# Altium project F4SDR2.PrjPcb
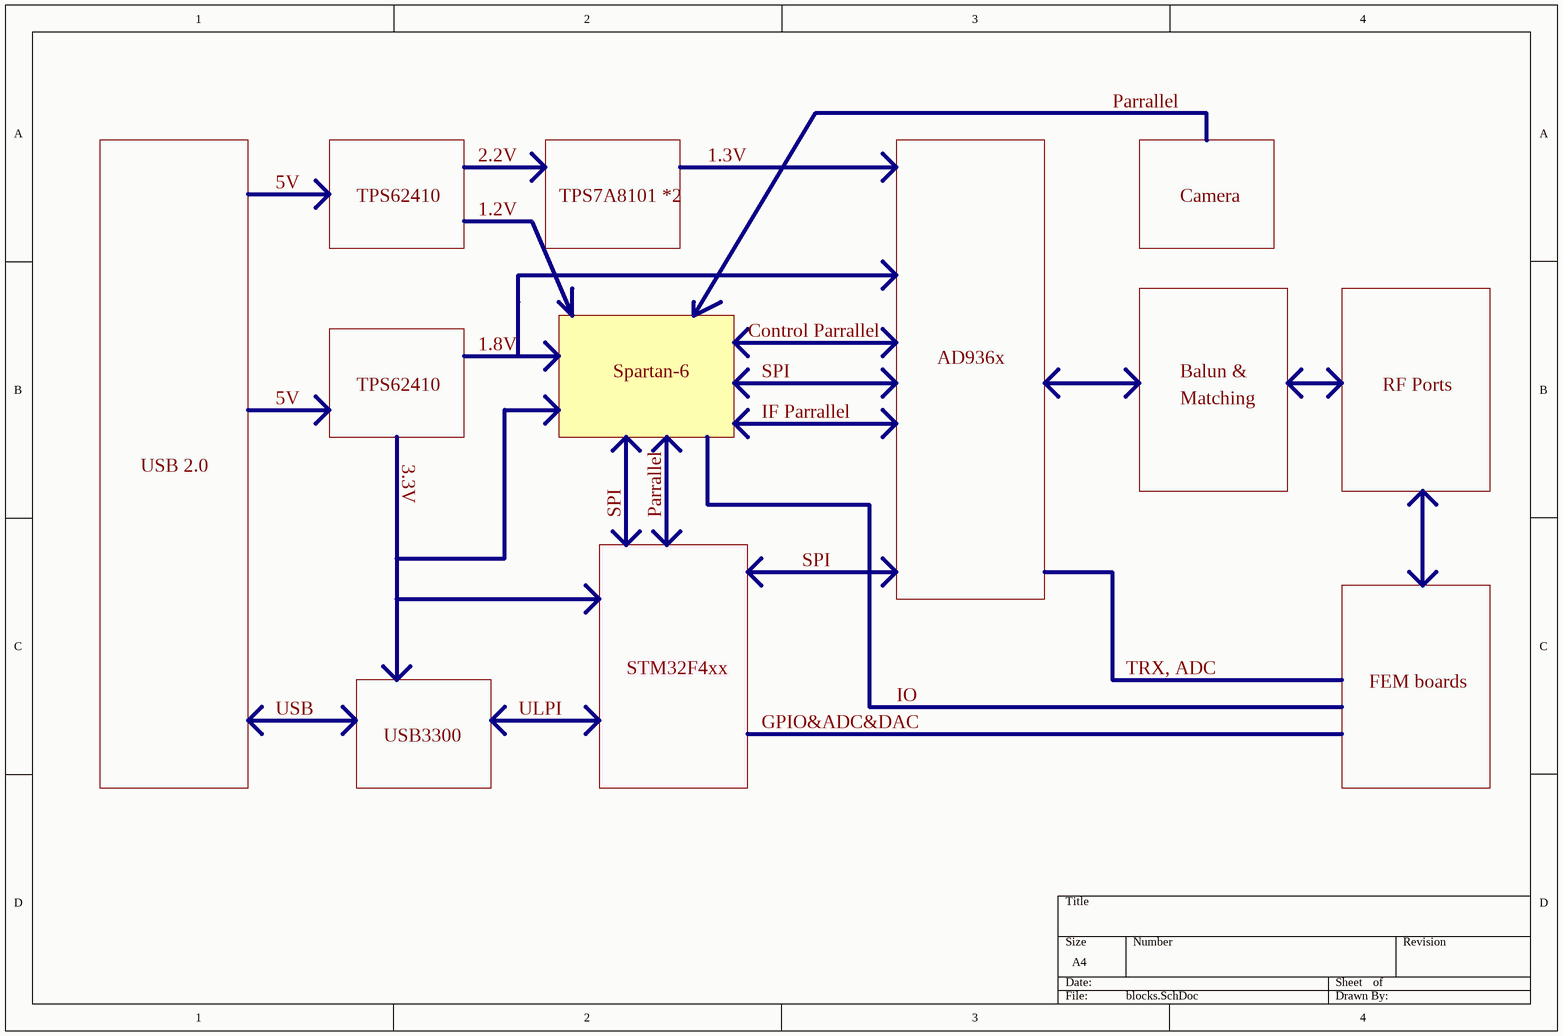
[diagram p0: blocks.SchDoc]
10 sheets, 215 parts. Net scope: flat (ports and power ports of the same name join across sheets).
Board file: F4SDR2.PcbDoc
Sheets:
  blocks.SchDoc
  power.SchDoc
  USB_HS_PHY.SchDoc
  AD936X.SchDoc
  mcu2.SchDoc
  Balun&Matching.SchDoc
  FPGA_IO_MCU.SchDoc
  FPGA_Configuration_power.SchDoc
  FPGA_IO_Transceiver.SchDoc
  camera.SchDoc

## Sheet blocks.SchDoc
size A4

### Notes on the sheet
- Parrallel
- 2.2V
- 1.3V
- 5V
- TPS62410
- 1.2V
- TPS7A8101 *2
- Camera
- 1.8V
- Spartan-6
- Control Parrallel
- SPI
- AD936x
- Balun &
- IF Parrallel
- Matching
- RF Ports
- USB 2.0
- 3.3V
- USB
- ULPI
- STM32F4xx
- IO
- TRX, ADC
- FEM boards
- USB3300
- GPIO&ADC&DAC

## Sheet power.SchDoc
size A4
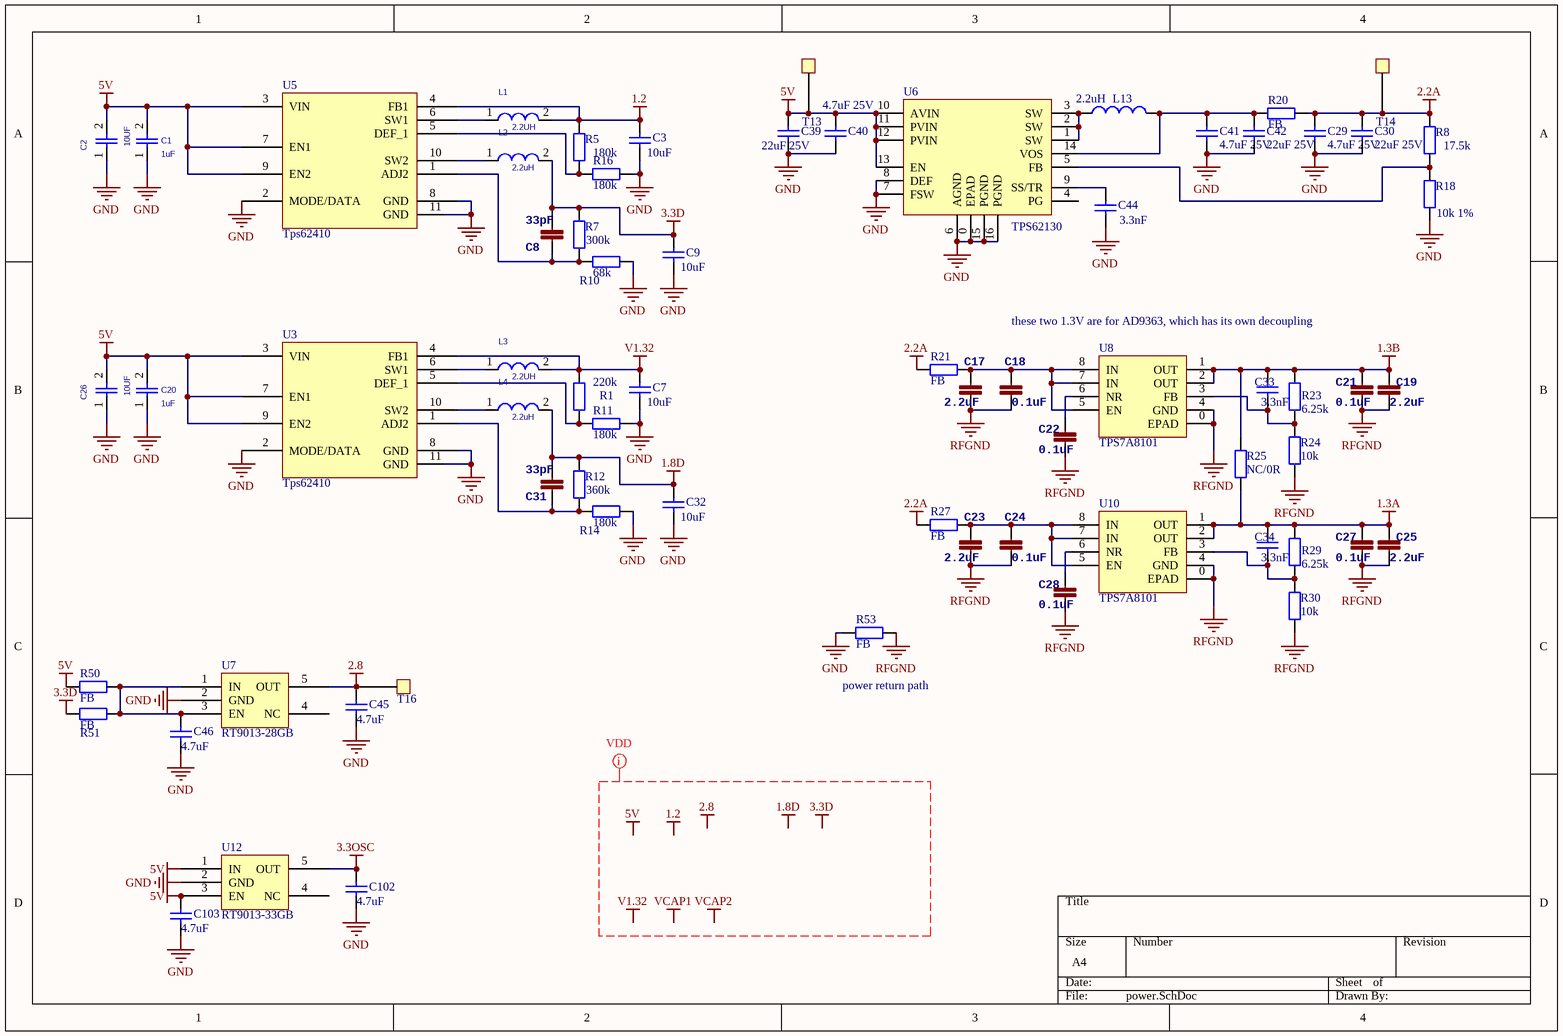
[diagram p1: power.SchDoc]

### Parts
C1  1uF  [0603]
C2  10UF  [0805]
C3  10uF  [0805]
C7  10uF  [0805]
C8  33pF  [0402]
C9  10uF  [0805]
C17  2.2uF  [0603]
C18  0.1uF  [0402]
C19  2.2uF  [0603]
C20  1uF  [0603]
C21  0.1uF  [0603]
C22  0.1uF  [0402]
C23  2.2uF  [0603]
C24  0.1uF  [0402]
C25  2.2uF  [0603]
C26  10UF  [0805]
C27  0.1uF  [0603]
C28  0.1uF  [0402]
C29  value 4.7uF 25V  [0603]  (hidden comment: Cap)
C30  value 22uF 25V  [0805]  (hidden comment: Cap)
C31  33pF  [0402]
C32  10uF  [0805]
C33  3.3nF  [0402]
C34  3.3nF  [0402]
C39  value 22uF 25V  [0805]  (hidden comment: Cap)
C40  value 4.7uF 25V  [0603]  (hidden comment: Cap)
C41  value 4.7uF 25V  [0603]  (hidden comment: Cap)
C42  value 22uF 25V  [0805]  (hidden comment: Cap)
C44  3.3nF  [0402]
C45  4.7uF  [0603]
C46  4.7uF  [0603]
C102  4.7uF  [0603]
C103  4.7uF  [0603]
L1  2.2UH  [0806]
L2  2.2uH  [0806]
L3  2.2UH  [0806]
L4  2.2uH  [0806]
L13  2.2uH  [L3015]
R1  220k  [0402]
R5  180k  [0402]
R7  300k  [0402]
R8  17.5k  [0402]
R10  68k  [0402]
R11  180k  [0402]
R12  360k  [0402]
R14  180k  [0402]
R16  180k  [0402]
R18  10k 1%  [0402]
R20  FB  [0603]
R21  FB  [0603]
R23  6.25k  [0402]
R24  10k  [0402]
R25  NC/0R  [0603]
R27  FB  [0603]
R29  6.25k  [0402]
R30  10k  [0402]
R50  FB  [0603]
R51  FB  [0603]
R53  FB  [0603]
T13  TestPad  [TestPad - 1mm]  (value not drawn)
T14  TestPad  [TestPad - 1mm]  (value not drawn)
T16  TestPad  [TestPad - 1mm]  (value not drawn)
U3  Tps62410  [DFN-10P-3X3]
U5  Tps62410  [DFN-10P-3X3]
U6  TPS62130  [TPS62130]
U7  RT9013-28GB  [SOT23-5]
U8  TPS7A8101  [TPS7A8101]
U10  TPS7A8101  [TPS7A8101]
U12  RT9013-33GB  [SOT23-5]

### Nets
1.2: C3.2 L1.2 R5.1 U5.4(FB1)
1.3A: C25.2 C27.2 C34.1 R25.2 R29.1 U10.1(OUT) U10.2(OUT)
1.3B: C19.2 C21.2 C33.1 R23.1 R25.1 U8.1(OUT) U8.2(OUT)
1.8D: C31.1 C32.2 L4.2 R12.1
2.2A: C29.2 C30.2 R8.1 R20.1 R21.2 R27.2 T14.1
2.8: C45.2 T16.1 U7.5(OUT)
3.3D: C8.1 C9.2 L2.2 R7.1 R51.1
3.3OSC: C102.2 U12.5(OUT)
5V: C1.2 C2.2 C20.2 C26.2 C39.1 C40.1 C103.2 R50.1 T13.1 U3.3(VIN) U3.7(EN1) U3.9(EN2) U5.3(VIN) U5.7(EN1) U5.9(EN2) U6.10(AVIN) U6.11(PVIN) U6.12(PVIN) U6.13(EN) U12.1(IN) U12.3(EN)
GND: C1.1 C2.1 C3.1 C7.1 C9.1 C20.1 C26.1 C29.1 C30.1 C32.1 C39.2 C40.2 C41.1 C42.1 C44.2 C45.1 C46.1 C102.1 C103.1 R10.2 R11.2 R14.2 R16.2 R18.2 R53.2 U3.2(MODE/DATA) U3.8(GND) U3.11(GND) U5.2(MODE/DATA) U5.8(GND) U5.11(GND) U6.0(EPAD) U6.6(AGND) U6.7(FSW) U6.8(DEF) U6.15(PGND) U6.16(PGND) U7.2(GND) U12.2(GND)
RFGND: C17.1 C18.1 C19.1 C21.1 C22.1 C23.1 C24.1 C25.1 C27.1 C28.1 R24.2 R30.2 R53.1 U8.0(EPAD) U8.4(GND) U10.0(EPAD) U10.4(GND)
V1.32: C7.2 L3.2 R1.1 U3.4(FB1)
NetC8_2: C8.2 R7.2 R10.1 U5.1(ADJ2)
NetC17_2: C17.2 C18.2 R21.1 U8.5(EN) U8.7(IN) U8.8(IN)
NetC22_2: C22.2 U8.6(NR)
NetC23_2: C23.2 C24.2 R27.1 U10.5(EN) U10.7(IN) U10.8(IN)
NetC28_2: C28.2 U10.6(NR)
NetC31_2: C31.2 R12.2 R14.1 U3.1(ADJ2)
NetC33_2: C33.2 R23.2 R24.1 U8.3(FB)
NetC34_2: C34.2 R29.2 R30.1 U10.3(FB)
NetC41_2: C41.2 C42.2 L13.2 R20.2 U6.14(VOS)
NetC44_1: C44.1 U6.9(SS/TR)
NetC46_2: C46.2 R50.2 R51.2 U7.1(IN) U7.3(EN)
NetL1_1: L1.1 U5.6(SW1)
NetL2_1: L2.1 U5.10(SW2)
NetL3_1: L3.1 U3.6(SW1)
NetL4_1: L4.1 U3.10(SW2)
NetL13_1: L13.1 U6.1(SW) U6.2(SW) U6.3(SW)
NetR1_2: R1.2 R11.1 U3.5(DEF_1)
NetR5_2: R5.2 R16.1 U5.5(DEF_1)
NetR8_2: R8.2 R18.1 U6.5(FB)

Not connected (* = marked no-connect by the designer): U6 4(PG); U7 4(NC); U12 4(NC)

### Layout directives
net class VDD: 1.2, 1.8D, 2.8, 3.3D, 5V, V1.32, VCAP1, VCAP2

### Notes on the sheet
- these two 1.3V are for AD9363, which has its own decoupling
- (near R53) power return path
- Labels drawn without touching a wire or pin: 1.2, 1.8D, 2.8, 3.3D, 5V, V1.32, VCAP1, VCAP2

### Library data of the parts
C1 C2 C20 C26 = CAP/0402: 1st Part Field: 0402
C3 C7 C9 C29 C30 C32-C34 C39-C42 C44-C46 C102 C103 = Cap: Capacitor; Published: 8-Jun-2000; LatestRevisionDate: 17-Jul-2002; LatestRevisionNote: Re-released for DXP Platform.; PackageReference: RAD-0.3; Publisher: Altium Limited; PackageDescription: Radial Cap, Thru-Hole; 2 Leads; 0.3 in Pin Spacing
C8 C17-C19 C21-C25 C27 C28 C31 = CAP0402-CAP: <b>Capacitor</b> / Standard 0603 ceramic capacitor, and 0.1" leaded capacitor.; PARTNO: CC0402ZRY5V7BB104
L1-L4 = L/2.5*2.0
L13 = Inductor: Code_IEC: 1005; Published: 8-Jun-2000; LatestRevisionDate: 29-May-2009; LatestRevisionNote: IPC-7351 Footprint Added.; PackageReference: 0402-A; Publisher: Altium Limited; PackageDescription: Chip Inductor; Code_JEITA: 0402
R1 R5 R7 R8 R10-R12 R14 R16 R18 = Res2: Resistor; Published: 8-Jun-2000; LatestRevisionDate: 17-Jul-2002; LatestRevisionNote: Re-released for DXP Platform.; PackageReference: AXIAL-0.4; Publisher: Altium Limited; PackageDescription: Axial Device, Thru-Hole; 2 Leads; 0.4 in Pin Spacing
R20 R21 R23-R25 R27 R29 R30 R50 R51 R53 = Res2: Resistor; Value: 0Ohm; Published: 8-Jun-2000; LatestRevisionDate: 17-Jul-2002; LatestRevisionNote: Re-released for DXP Platform.; PackageReference: AXIAL-0.4; Publisher: Altium Limited; PackageDescription: Axial Device, Thru-Hole; 2 Leads; 0.4 in Pin Spacing
U7 U12 = LP5907

## Sheet USB_HS_PHY.SchDoc
size A4
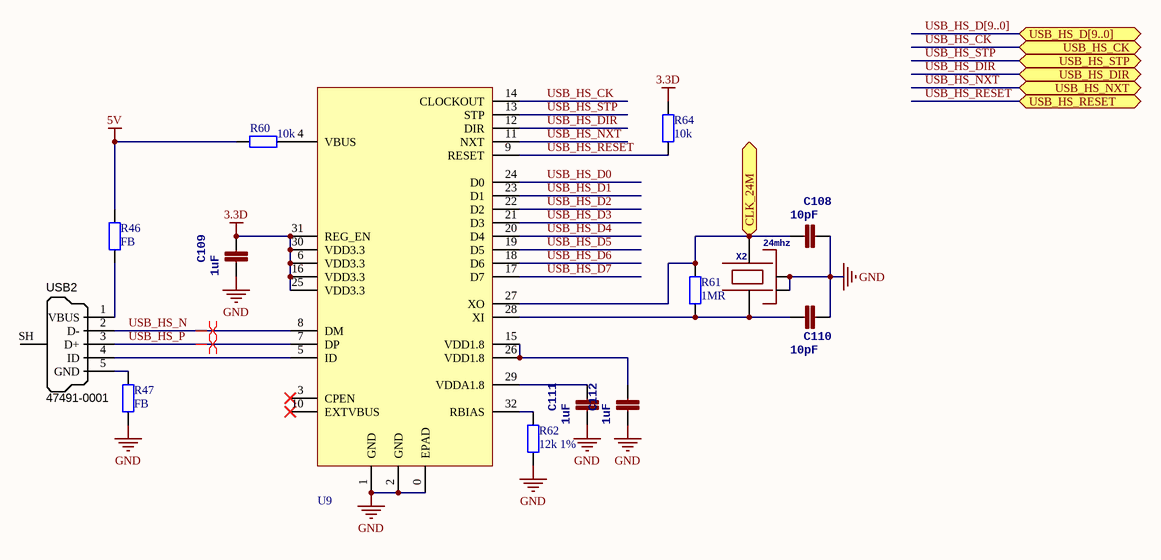
[diagram p2: USB_HS_PHY.SchDoc]

### Parts
C108  10pF  [0402]
C109  1uF  [0402]
C110  10pF  [0402]
C111  1uF  [0402]
C112  1uF  [0402]
R46  FB  [0603]
R47  FB  [0603]
R60  10k  [0402]
R61  1MR  [0402]
R62  12k 1%  [0402]
R64  10k  [0402]
U9  USB3300_1  [USB3300]  (value not drawn)
USB2  Manufacturer Part Number 1: 47491-0001  [MICRO-YZX]  (hidden comment: USB Micro Type B)
X2  24mhz  [OSCILLATOR-3.2X2.5]

### Ports
CLK_24M, USB_HS_CK, USB_HS_D[9..0], USB_HS_DIR, USB_HS_NXT, USB_HS_RESET, USB_HS_STP

### Nets
3.3D: C109.1 R64.2 U9.6(VDD3.3) U9.16(VDD3.3) U9.25(VDD3.3) U9.30(VDD3.3) U9.31(REG_EN)
5V: R46.1 R60.1
GND: C108.1 C109.2 C110.1 C111.2 C112.2 R47.2 R62.1 U9.0(EPAD) U9.1(GND) U9.2(GND) X2.2(NC_2) X2.4(NC_4)
CLK_24M: C108.2 R61.2 U9.27(XO) X2.3 ; port CLK_24M
USB_HS_CK: U9.14(CLOCKOUT) ; port USB_HS_CK
USB_HS_D0: U9.24(D0)
USB_HS_D1: U9.23(D1)
USB_HS_D2: U9.22(D2)
USB_HS_D3: U9.21(D3)
USB_HS_D4: U9.20(D4)
USB_HS_D5: U9.19(D5)
USB_HS_D6: U9.18(D6)
USB_HS_D7: U9.17(D7)
USB_HS_DIR: U9.12(DIR) ; port USB_HS_DIR
USB_HS_N: U9.8(DM) USB2.2(D-)
USB_HS_NXT: U9.11(NXT) ; port USB_HS_NXT
USB_HS_P: U9.7(DP) USB2.3(D+)
USB_HS_RESET: R64.1 U9.9(RESET) ; port USB_HS_RESET
USB_HS_STP: U9.13(STP) ; port USB_HS_STP
NetC110_2: C110.2 R61.1 U9.28(XI) X2.1
NetC111_1: C111.1 U9.29(VDDA1.8)
NetC112_1: C112.1 U9.15(VDD1.8) U9.26(VDD1.8)
NetR46_2: R46.2 USB2.1(VBUS)
NetR47_1: R47.1 USB2.5(GND)
NetR60_2: R60.2 U9.4(VBUS)
NetR62_2: R62.2 U9.32(RBIAS)
NetU9_5: U9.5(ID) USB2.4(ID)

Not connected (* = marked no-connect by the designer): U9 3(CPEN)* 10(EXTVBUS)*; USB2 SH(Shell)

### Buses and harness runs
bus USB_HS_D[9..0] = port USB_HS_D[9..0]

### Layout directives
differential pair: USB_HS_N, USB_HS_P

### Library data of the parts
C108-C112 = CAP0402-CAP: as C8 on sheet power
R46 R47 R60-R62 R64 = Res2: Resistor; Value: 0Ohm; Published: 8-Jun-2000; LatestRevisionDate: 17-Jul-2002; LatestRevisionNote: Re-released for DXP Platform.; PackageReference: AXIAL-0.4; Publisher: Altium Limited; PackageDescription: Axial Device, Thru-Hole; 2 Leads; 0.4 in Pin Spacing
USB2 = USB_Micro_TypeB: Connector SMD USB Micro Type B middle mount; Manufacturer 1: Molex Inc; SCDType: undef; Package / Case: SMD; Supplier 1: Digi-Key; Supplier Part Number 1: WM17142CT-ND
X2 = OSCILLATOR-3.2X2.5: Crystal Oscillator in 3.2x2.5 SMD

## Sheet AD936X.SchDoc
size A4
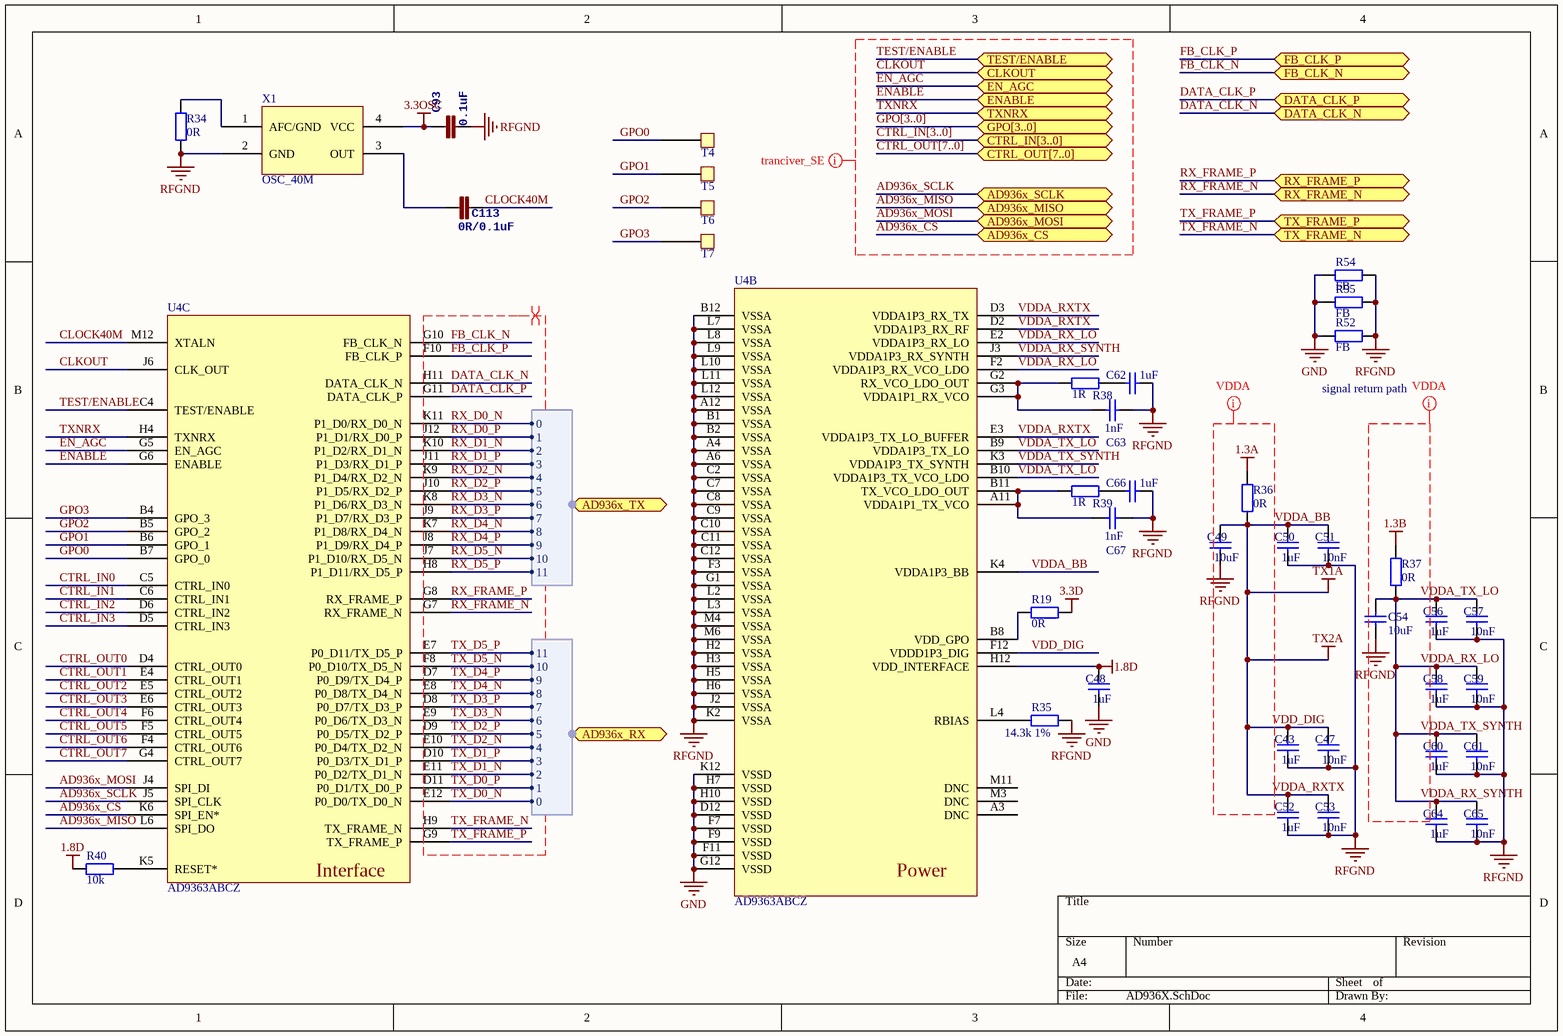
[diagram p3: AD936X.SchDoc]

### Parts
C43  1uF  [0402]
C47  10nF  [0402]
C48  1uF  [0402]
C49  10uF  [0805]
C50  1uF  [0402]
C51  10nF  [0402]
C52  1uF  [0402]
C53  10nF  [0402]
C54  10uF  [0805]
C56  1uF  [0402]
C57  10nF  [0402]
C58  1uF  [0402]
C59  10nF  [0402]
C60  1uF  [0402]
C61  10nF  [0402]
C62  1uF  [0402]
C63  1nF  [0402]
C64  1uF  [0402]
C65  10nF  [0402]
C66  1uF  [0402]
C67  1nF  [0402]
C93  0.1uF  [0402]
C113  0R/0.1uF  [0402]
R19  0R  [0402]
R34  0R  [0402]
R35  14.3k 1%  [0603]
R36  0R  [0603]
R37  0R  [0603]
R38  1R  [0402]
R39  1R  [0402]
R40  10k  [0402]
R52  FB  [0402]
R54  FB  [0402]
R55  FB  [0402]
T4  TestPad  [TestPad - 1mm]  (value not drawn)
T5  TestPad  [TestPad - 1mm]  (value not drawn)
T6  TestPad  [TestPad - 1mm]  (value not drawn)
T7  TestPad  [TestPad - 1mm]  (value not drawn)
U4  AD9363ABCZ  [AD936X]  (parts B,C of 3)
X1  OSC_40M  [TXC_7Q]

### Ports
AD936x_CS, AD936x_MISO, AD936x_MOSI, AD936x_RX (harness Harness), AD936x_SCLK, AD936x_TX (harness Harness), CLKOUT, CTRL_IN[3..0], CTRL_OUT[7..0], DATA_CLK_N, DATA_CLK_P, EN_AGC, ENABLE, FB_CLK_N, FB_CLK_P, GPO[3..0], RX_FRAME_N, RX_FRAME_P, TEST/ENABLE, TX_FRAME_N, TX_FRAME_P, TXNRX

### Harnesses
Harness: 0, 1, 2, 3, 4, 5, 6, 7, 8, 9, 10, 11

### Nets
1.3A: R36.1
1.3B: R37.1
1.8D: C48.1 R40.2 U4.H12(VDD_INTERFACE)
3.3D: R19.2
3.3OSC: C93.1 X1.4(VCC)
GND: C48.2 R52.2 R54.2 R55.2 U4.D12(VSSD) U4.F7(VSSD) U4.F9(VSSD) U4.F11(VSSD) U4.G12(VSSD) U4.H7(VSSD) U4.H10(VSSD) U4.K12(VSSD)
RFGND: C43.2 C47.2 C49.2 C50.2 C51.2 C52.2 C53.2 C54.1 C56.2 C57.2 C58.2 C59.2 C60.2 C61.2 C62.2 C63.2 C64.2 C65.2 C66.2 C67.2 C93.2 R34.2 R35.2 R52.1 R54.1 R55.1 U4.A4(VSSA) U4.A6(VSSA) U4.A12(VSSA) U4.B1(VSSA) U4.B2(VSSA) U4.B12(VSSA) U4.C2(VSSA) U4.C7(VSSA) U4.C8(VSSA) U4.C9(VSSA) U4.C10(VSSA) U4.C11(VSSA) U4.C12(VSSA) U4.F3(VSSA) U4.G1(VSSA) U4.H2(VSSA) U4.H3(VSSA) U4.H5(VSSA) U4.H6(VSSA) U4.J2(VSSA) U4.K2(VSSA) U4.L2(VSSA) U4.L3(VSSA) U4.L7(VSSA) U4.L8(VSSA) U4.L9(VSSA) U4.L10(VSSA) U4.L11(VSSA) U4.L12(VSSA) U4.M4(VSSA) U4.M6(VSSA) X1.2(GND)
VDD_DIG: C43.1 C47.1 C49.1 C50.1 C51.1 C52.1 C53.1 R36.2 U4.D2(VDDA1P3_RX_RF) U4.D3(VDDA1P3_RX_TX) U4.E3(VDDA1P3_TX_LO_BUFFER) U4.F12(VDDD1P3_DIG) U4.K4(VDDA1P3_BB)  [also labelled TX1A, TX2A, VDDA_BB, VDDA_RXTX]
AD936x_CS: U4.K6(SPI_EN*) ; port AD936x_CS
AD936x_MISO: U4.L6(SPI_DO) ; port AD936x_MISO
AD936x_MOSI: U4.J4(SPI_DI) ; port AD936x_MOSI
AD936x_SCLK: U4.J5(SPI_CLK) ; port AD936x_SCLK
CLKOUT: U4.J6(CLK_OUT) ; port CLKOUT
CLOCK40M: C113.2 U4.M12(XTALN)
CTRL_IN0: U4.C5(CTRL_IN0)
CTRL_IN1: U4.C6(CTRL_IN1)
CTRL_IN2: U4.D6(CTRL_IN2)
CTRL_IN3: U4.D5(CTRL_IN3)
CTRL_OUT0: U4.D4(CTRL_OUT0)
CTRL_OUT1: U4.E4(CTRL_OUT1)
CTRL_OUT2: U4.E5(CTRL_OUT2)
CTRL_OUT3: U4.E6(CTRL_OUT3)
CTRL_OUT4: U4.F6(CTRL_OUT4)
CTRL_OUT5: U4.F5(CTRL_OUT5)
CTRL_OUT6: U4.F4(CTRL_OUT6)
CTRL_OUT7: U4.G4(CTRL_OUT7)
DATA_CLK_N: U4.H11(DATA_CLK_N) ; port DATA_CLK_N
DATA_CLK_P: U4.G11(DATA_CLK_P) ; port DATA_CLK_P
EN_AGC: U4.G5(EN_AGC) ; port EN_AGC
ENABLE: U4.G6(ENABLE) ; port ENABLE
FB_CLK_N: U4.G10(FB_CLK_N) ; port FB_CLK_N
FB_CLK_P: U4.F10(FB_CLK_P) ; port FB_CLK_P
GPO0: T4.1 U4.B7(GPO_0)
GPO1: T5.1 U4.B6(GPO_1)
GPO2: T6.1 U4.B5(GPO_2)
GPO3: T7.1 U4.B4(GPO_3)
RX_D0_N: U4.K11(P1_D0/RX_D0_N) ; port AD936x_TX.0
RX_D0_P: U4.J12(P1_D1/RX_D0_P) ; port AD936x_TX.1
RX_D1_N: U4.K10(P1_D2/RX_D1_N) ; port AD936x_TX.2
RX_D1_P: U4.J11(P1_D3/RX_D1_P) ; port AD936x_TX.3
RX_D2_N: U4.K9(P1_D4/RX_D2_N) ; port AD936x_TX.4
RX_D2_P: U4.J10(P1_D5/RX_D2_P) ; port AD936x_TX.5
RX_D3_N: U4.K8(P1_D6/RX_D3_N) ; port AD936x_TX.6
RX_D3_P: U4.J9(P1_D7/RX_D3_P) ; port AD936x_TX.7
RX_D4_N: U4.K7(P1_D8/RX_D4_N) ; port AD936x_TX.8
RX_D4_P: U4.J8(P1_D9/RX_D4_P) ; port AD936x_TX.9
RX_D5_N: U4.J7(P1_D10/RX_D5_N) ; port AD936x_TX.10
RX_D5_P: U4.H8(P1_D11/RX_D5_P) ; port AD936x_TX.11
RX_FRAME_N: U4.G7(RX_FRAME_N) ; port RX_FRAME_N
RX_FRAME_P: U4.G8(RX_FRAME_P) ; port RX_FRAME_P
TEST/ENABLE: U4.C4(TEST/ENABLE) ; port TEST/ENABLE
TX_D0_N: U4.E12(P0_D0/TX_D0_N) ; port AD936x_RX.0
TX_D0_P: U4.D11(P0_D1/TX_D0_P) ; port AD936x_RX.1
TX_D1_N: U4.E11(P0_D2/TX_D1_N) ; port AD936x_RX.2
TX_D1_P: U4.D10(P0_D3/TX_D1_P) ; port AD936x_RX.3
TX_D2_N: U4.E10(P0_D4/TX_D2_N) ; port AD936x_RX.4
TX_D2_P: U4.D9(P0_D5/TX_D2_P) ; port AD936x_RX.5
TX_D3_N: U4.E9(P0_D6/TX_D3_N) ; port AD936x_RX.6
TX_D3_P: U4.D8(P0_D7/TX_D3_P) ; port AD936x_RX.7
TX_D4_N: U4.E8(P0_D8/TX_D4_N) ; port AD936x_RX.8
TX_D4_P: U4.D7(P0_D9/TX_D4_P) ; port AD936x_RX.9
TX_D5_N: U4.F8(P0_D10/TX_D5_N) ; port AD936x_RX.10
TX_D5_P: U4.E7(P0_D11/TX_D5_P) ; port AD936x_RX.11
TX_FRAME_N: U4.H9(TX_FRAME_N) ; port TX_FRAME_N
TX_FRAME_P: U4.G9(TX_FRAME_P) ; port TX_FRAME_P
TXNRX: U4.H4(TXNRX) ; port TXNRX
VDDA_RX_LO: C54.2 C56.1 C57.1 C58.1 C59.1 C60.1 C61.1 C64.1 C65.1 R37.2 U4.B9(VDDA1P3_TX_LO) U4.B10(VDDA1P3_TX_VCO_LDO) U4.E2(VDDA1P3_RX_LO) U4.F2(VDDA1P3_RX_VCO_LDO) U4.J3(VDDA1P3_RX_SYNTH) U4.K3(VDDA1P3_TX_SYNTH)  [also labelled VDDA_RX_SYNTH, VDDA_TX_LO, VDDA_TX_SYNTH]
NetC62_1: C62.1 R38.1
NetC63_1: C63.1 R38.2 U4.G2(RX_VCO_LDO_OUT) U4.G3(VDDA1P1_RX_VCO)
NetC66_1: C66.1 R39.1
NetC67_1: C67.1 R39.2 U4.A11(VDDA1P1_TX_VCO) U4.B11(TX_VCO_LDO_OUT)
NetC113_1: C113.1 X1.3(OUT)
NetR19_1: R19.1 U4.B8(VDD_GPO)
NetR34_1: R34.1 X1.1(AFC/GND)
NetR35_1: R35.1 U4.L4(RBIAS)
NetR40_1: R40.1 U4.K5(RESET*)

Not connected (* = marked no-connect by the designer): U4 A3(DNC) M3(DNC) M11(DNC)

### Buses and harness runs
bus CTRL_IN[3..0] = port CTRL_IN[3..0]
bus CTRL_OUT[7..0] = port CTRL_OUT[7..0]
bus GPO[3..0] = port GPO[3..0]

### Layout directives
differential pair: DATA_CLK_N, DATA_CLK_P, FB_CLK_N, FB_CLK_P, RX_D0_N, RX_D0_P, RX_D1_N, RX_D1_P, RX_D2_N, RX_D2_P, RX_D3_N, RX_D3_P, RX_D4_N, RX_D4_P, RX_D5_N, RX_D5_P, RX_FRAME_N, RX_FRAME_P, TX_D0_N, TX_D0_P, TX_D1_N, TX_D1_P, TX_D2_N, TX_D2_P, TX_D3_N, TX_D3_P, TX_D4_N, TX_D4_P, TX_D5_N, TX_D5_P, TX_FRAME_N, TX_FRAME_P
net class VDDA: 1.3A, 1.3B, RFGND, VDD_DIG, VDDA_BB, VDDA_RX_LO, VDDA_RX_SYNTH, VDDA_RXTX, VDDA_TX_LO, VDDA_TX_SYNTH
net class tranciver_SE: AD936x_CS, AD936x_MISO, AD936x_MOSI, AD936x_SCLK, CLKOUT, CTRL_IN[3..0], CTRL_OUT[7..0], EN_AGC, ENABLE, GPO[3..0], TEST/ENABLE, TXNRX

### Notes on the sheet
- (near R52) signal return path
- (in symbol AD9363ABCZ, part B) Power
- (in symbol AD9363ABCZ, part C) Interface

### Library data of the parts
C43 C47-C54 C56-C67 = Cap: Capacitor; Published: 8-Jun-2000; LatestRevisionDate: 17-Jul-2002; LatestRevisionNote: Re-released for DXP Platform.; PackageReference: RAD-0.3; Publisher: Altium Limited; PackageDescription: Radial Cap, Thru-Hole; 2 Leads; 0.3 in Pin Spacing
C93 C113 = CAP0402-CAP: as C8 on sheet power
R19 R34-R40 R52 R54 R55 = Res2: Resistor; Value: 0Ohm; Published: 8-Jun-2000; LatestRevisionDate: 17-Jul-2002; LatestRevisionNote: Re-released for DXP Platform.; PackageReference: AXIAL-0.4; Publisher: Altium Limited; PackageDescription: Axial Device, Thru-Hole; 2 Leads; 0.4 in Pin Spacing
U4 = AD9363ABCZ: Imported; Value: Value; Type: Type; RefDes: RefDes

## Sheet mcu2.SchDoc
size A4
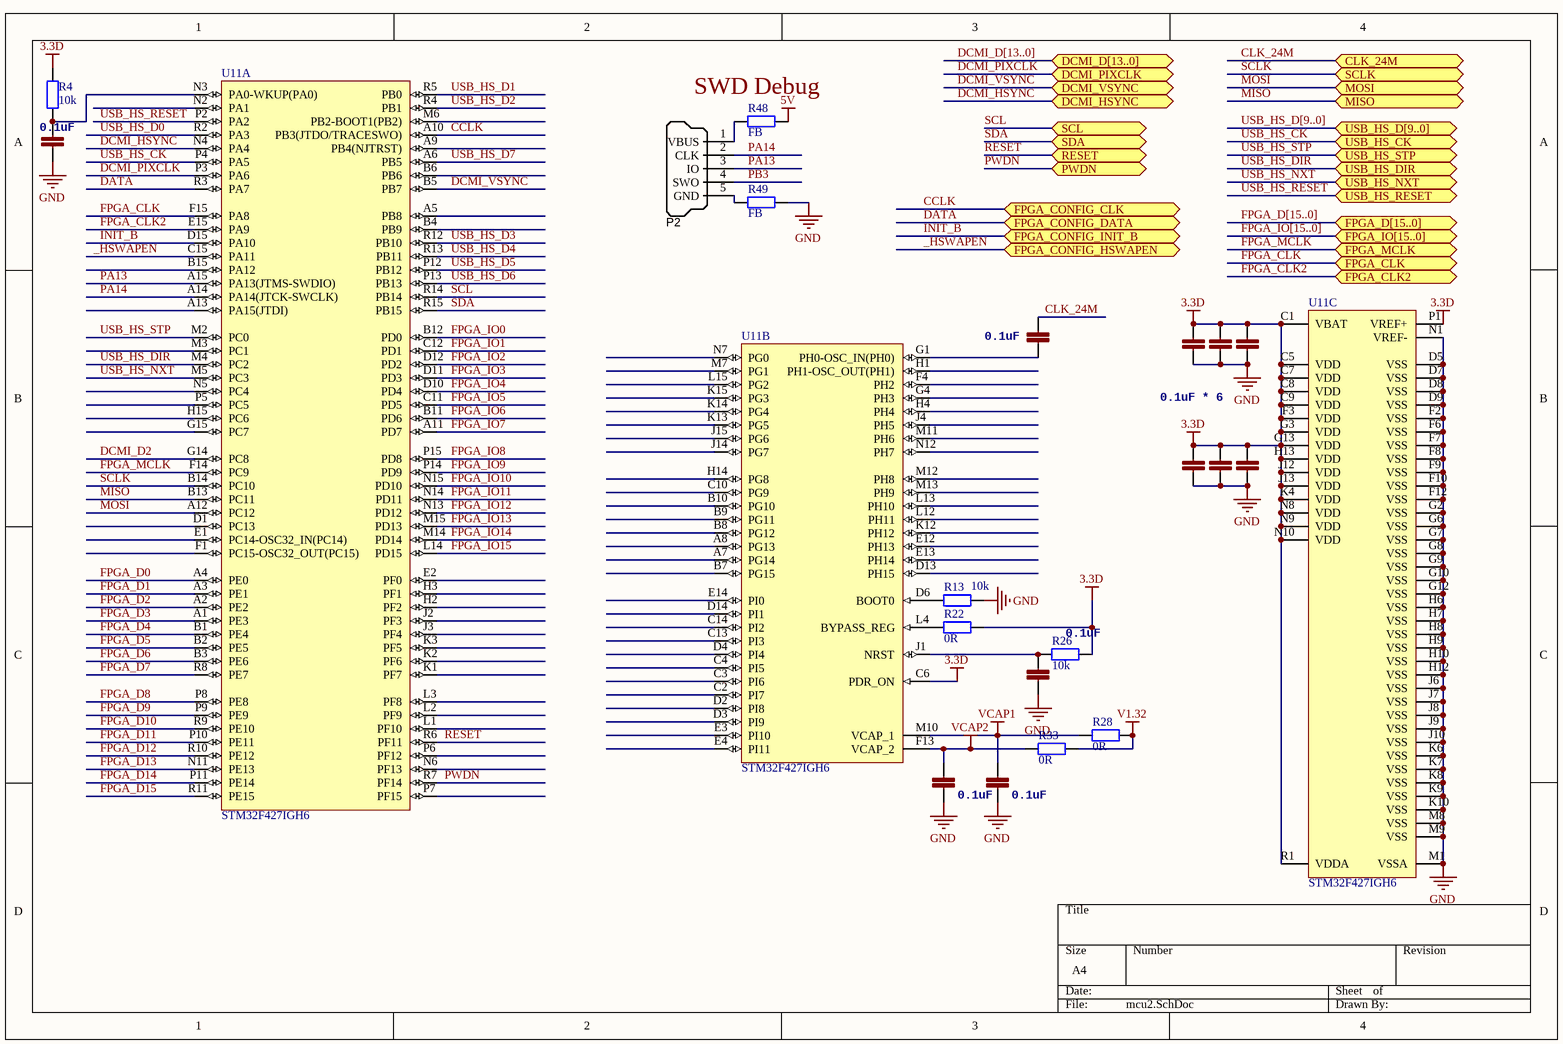
[diagram p4: mcu2.SchDoc]

### Parts
C4  0.1uF * 6  [0402]  (value not drawn)
C5  0.1uF  [0402]  (value not drawn)
C6  0.1uF  [0402]  (value not drawn)
C12  0.1uF  [0402]
C13  0.1uF  [0402]  (value not drawn)
C14  0.1uF  [0402]  (value not drawn)
C15  0.1uF  [0402]
C35  0.1uF * 6  [0402]
C36  0.1uF  [0402]
C37  0.1uF  [0402]
C38  0.1uF  [0402]
P2  SWD_MicroUSB  [MICRO-YZX]  (value not drawn)
R4  10k  [0402]
R13  10k  [0402]
R22  0R  [0402]
R26  10k  [0402]
R28  0R  [0402]
R33  0R  [0402]
R48  FB  [0603]
R49  FB  [0603]
U11  STM32F427IGH6  [STM-UFBGA176+25_M]  (parts A,B,C of 3)

### Ports
CLK_24M, DCMI_D[13..0], DCMI_HSYNC, DCMI_PIXCLK, DCMI_VSYNC, FPGA_CLK, FPGA_CLK2, FPGA_CONFIG_CLK, FPGA_CONFIG_DATA, FPGA_CONFIG_HSWAPEN, FPGA_CONFIG_INIT_B, FPGA_D[15..0], FPGA_IO[15..0], FPGA_MCLK, MISO, MOSI, PWDN, RESET, SCL, SCLK, SDA, USB_HS_CK, USB_HS_D[9..0], USB_HS_DIR, USB_HS_NXT, USB_HS_RESET, USB_HS_STP

### Nets
3.3D: C4.2 C5.2 C6.2 C13.2 C14.2 C35.2 R4.1 R22.1 R26.2 U11.C1(VBAT) U11.C5(VDD) U11.C6(PDR_ON) U11.C7(VDD) U11.C8(VDD) U11.C9(VDD) U11.F3(VDD) U11.G3(VDD) U11.G13(VDD) U11.H13(VDD) U11.J12(VDD) U11.J13(VDD) U11.K4(VDD) U11.N8(VDD) U11.N9(VDD) U11.N10(VDD) U11.P1(VREF+) U11.R1(VDDA)
5V: R48.1
GND: C4.1 C5.1 C6.1 C12.1 C13.1 C14.1 C35.1 C36.1 C37.1 C38.1 R13.1 R49.1 U11.D5(VSS) U11.D7(VSS) U11.D8(VSS) U11.D9(VSS) U11.F2(VSS) U11.F6(VSS) U11.F7(VSS) U11.F8(VSS) U11.F9(VSS) U11.F10(VSS) U11.F12(VSS) U11.G2(VSS) U11.G6(VSS) U11.G7(VSS) U11.G8(VSS) U11.G9(VSS) U11.G10(VSS) U11.G12(VSS) U11.H6(VSS) U11.H7(VSS) U11.H8(VSS) U11.H9(VSS) U11.H10(VSS) U11.H12(VSS) U11.J6(VSS) U11.J7(VSS) U11.J8(VSS) U11.J9(VSS) U11.J10(VSS) U11.K6(VSS) U11.K7(VSS) U11.K8(VSS) U11.K9(VSS) U11.K10(VSS) U11.M1(VSSA) U11.M8(VSS) U11.M9(VSS) U11.N1(VREF-)
V1.32: R28.2 R33.2
VCAP1: C38.2 R28.1 U11.M10(VCAP_1)
VCAP2: C37.2 R33.1 U11.F13(VCAP_2)
_HSWAPEN: U11.C15(PA11) ; port FPGA_CONFIG_HSWAPEN
CCLK: U11.A10(PB3(JTDO/TRACESWO)) ; port FPGA_CONFIG_CLK
CLK_24M: C15.2 ; port CLK_24M
DATA: U11.R3(PA7) ; port FPGA_CONFIG_DATA
DCMI_D2: U11.G14(PC8)
DCMI_HSYNC: U11.N4(PA4) ; port DCMI_HSYNC
DCMI_PIXCLK: U11.P3(PA6) ; port DCMI_PIXCLK
DCMI_VSYNC: U11.B5(PB7) ; port DCMI_VSYNC
FPGA_CLK: U11.F15(PA8) ; port FPGA_CLK
FPGA_CLK2: U11.E15(PA9) ; port FPGA_CLK2
FPGA_D0: U11.A4(PE0)
FPGA_D1: U11.A3(PE1)
FPGA_D2: U11.A2(PE2)
FPGA_D3: U11.A1(PE3)
FPGA_D4: U11.B1(PE4)
FPGA_D5: U11.B2(PE5)
FPGA_D6: U11.B3(PE6)
FPGA_D7: U11.R8(PE7)
FPGA_D8: U11.P8(PE8)
FPGA_D9: U11.P9(PE9)
FPGA_D10: U11.R9(PE10)
FPGA_D11: U11.P10(PE11)
FPGA_D12: U11.R10(PE12)
FPGA_D13: U11.N11(PE13)
FPGA_D14: U11.P11(PE14)
FPGA_D15: U11.R11(PE15)
FPGA_IO0: U11.B12(PD0)
FPGA_IO1: U11.C12(PD1)
FPGA_IO2: U11.D12(PD2)
FPGA_IO3: U11.D11(PD3)
FPGA_IO4: U11.D10(PD4)
FPGA_IO5: U11.C11(PD5)
FPGA_IO6: U11.B11(PD6)
FPGA_IO7: U11.A11(PD7)
FPGA_IO8: U11.P15(PD8)
FPGA_IO9: U11.P14(PD9)
FPGA_IO10: U11.N15(PD10)
FPGA_IO11: U11.N14(PD11)
FPGA_IO12: U11.N13(PD12)
FPGA_IO13: U11.M15(PD13)
FPGA_IO14: U11.M14(PD14)
FPGA_IO15: U11.L14(PD15)
FPGA_MCLK: U11.F14(PC9) ; port FPGA_MCLK
INIT_B: U11.D15(PA10) ; port FPGA_CONFIG_INIT_B
MISO: U11.B13(PC11) ; port MISO
MOSI: U11.A12(PC12) ; port MOSI
PA13: P2.3(IO) U11.A15(PA13(JTMS-SWDIO))
PA14: P2.2(CLK) U11.A14(PA14(JTCK-SWCLK))
PB3: P2.4(SWO)
PWDN: U11.R7(PF14) ; port PWDN
RESET: U11.R6(PF11) ; port RESET
SCL: U11.R14(PB14) ; port SCL
SCLK: U11.B14(PC10) ; port SCLK
SDA: U11.R15(PB15) ; port SDA
USB_HS_CK: U11.P4(PA5) ; port USB_HS_CK
USB_HS_D0: U11.R2(PA3)
USB_HS_D1: U11.R5(PB0)
USB_HS_D2: U11.R4(PB1)
USB_HS_D3: U11.R12(PB10)
USB_HS_D4: U11.R13(PB11)
USB_HS_D5: U11.P12(PB12)
USB_HS_D6: U11.P13(PB13)
USB_HS_D7: U11.A6(PB5)
USB_HS_DIR: U11.M4(PC2) ; port USB_HS_DIR
USB_HS_NXT: U11.M5(PC3) ; port USB_HS_NXT
USB_HS_RESET: U11.P2(PA2) ; port USB_HS_RESET
USB_HS_STP: U11.M2(PC0) ; port USB_HS_STP
NetC12_2: C12.2 R4.2 U11.N3(PA0-WKUP(PA0))
NetC15_1: C15.1 U11.G1(PH0-OSC_IN(PH0))
NetC36_2: C36.2 R26.1 U11.J1(NRST)
NetP2_1: P2.1(VBUS) R48.2
NetP2_5: P2.5(GND) R49.2
NetR13_2: R13.2 U11.D6(BOOT0)
NetR22_2: R22.2 U11.L4(BYPASS_REG)

Not connected (* = marked no-connect by the designer): U11 A5(PB8) A7(PG14) A8(PG13) A9(PB4(NJTRST)) A13(PA15(JTDI)) B4(PB9) B6(PB6) B7(PG15) B8(PG12) B9(PG11) B10(PG10) B15(PA12) C2(PI7) C3(PI6) C4(PI5) C10(PG9) C13(PI3) C14(PI2) D1(PC13) D2(PI8) D3(PI9) D4(PI4) D13(PH15) D14(PI1) E1(PC14-OSC32_IN(PC14)) E2(PF0) E3(PI10) E4(PI11) E12(PH13) E13(PH14) E14(PI0) F1(PC15-OSC32_OUT(PC15)) F4(PH2) G4(PH3) G15(PC7) H1(PH1-OSC_OUT(PH1)) H2(PF2) H3(PF1) H4(PH4) H14(PG8) H15(PC6) J2(PF3) J3(PF4) J4(PH5) J14(PG7) J15(PG6) K1(PF7) K2(PF6) K3(PF5) K12(PH12) K13(PG5) K14(PG4) K15(PG3) L1(PF10) L2(PF9) L3(PF8) L12(PH11) L13(PH10) L15(PG2) M3(PC1) M6(PB2-BOOT1(PB2)) M7(PG1) M11(PH6) M12(PH8) M13(PH9) N2(PA1) N5(PC4) N6(PF13) N7(PG0) N12(PH7) P5(PC5) P6(PF12) P7(PF15)

### Buses and harness runs
bus DCMI_D[13..0] = port DCMI_D[13..0]
bus FPGA_D[15..0] = port FPGA_D[15..0]
bus FPGA_IO[15..0] = port FPGA_IO[15..0]
bus USB_HS_D[9..0] = port USB_HS_D[9..0]

### Notes on the sheet
- (near R48) SWD Debug

### Library data of the parts
C4-C6 C12-C15 C35-C38 = CAP0402-CAP: as C8 on sheet power
P2 = SWD_MicroUSB: Connector SMD USB Micro Type B middle mount; Manufacturer 1: Molex Inc; SCDType: undef; Package / Case: SMD; Supplier 1: Digi-Key; Supplier Part Number 1: WM17142CT-ND
R4 R13 R22 R26 R28 R33 R48 R49 = Res2: Resistor; Value: 0Ohm; Published: 8-Jun-2000; LatestRevisionDate: 17-Jul-2002; LatestRevisionNote: Re-released for DXP Platform.; PackageReference: AXIAL-0.4; Publisher: Altium Limited; PackageDescription: Axial Device, Thru-Hole; 2 Leads; 0.4 in Pin Spacing
U11 = STM32F427IGH6: ARM Cortex-M4 32-bit MCU+FPU, 210 DMIPS, 1024 kB Flash, 256 kB Internal RAM, 140 I/Os, 176-pin UFBGA, -40 to 85 degC, Tray; Manufacturer: STMicroelectronics; D/A Converter: 2x12-bit; FLASH Size (Prog) (kB): 1024; I/Os (High Current): 140; Internal RAM Size (kB): 256; Operating Frequency(F) (Processor speed) (MHz): 168; Supply Voltage(Vcc) max (V): 3.6; Supply Voltage(Vcc) min (V): 1.8; DatasheetVersion: Rev. 1; PackageVersion: Rev. 4, 06/2013; PackageReference: UFBGA176+25; PackageDescription: 176+25-Ball Ultra Thin Fine Pitch Ball Grid Array, 10 x 10 x 0.6 mm Body, 0.65 mm Pitch; Supplier 1: Digi-Key; Supplier Part Number 1: STM32F427IGH6-ND; Supplier 2: Newark; Supplier Part Number 2: 06X3665; Supplier 3: Mouser; Supplier Part Number 3: 511-STM32F427IGH6; Core: ARM Cortex-M4; Packing: Tray; Mounting Technology: Surface Mount; PartNumber: STM32F427IGH6; ComponentLink1Description: Manufacturer URL; ComponentLink1URL: http://www.st.com/web/en/home.html; ComponentLink2Description: Datasheet; ComponentLink2URL: http://www.st.com/st-web-ui/static/active/en/resource/technical/document/datasheet/DM00071990.pdf; ComponentLink3Description: Package Specification; ComponentLink3URL: http://www.st.com/st-web-ui/static/active/en/resource/technical/document/datasheet/DM00037051.pdf

## Sheet Balun&Matching.SchDoc
size A4
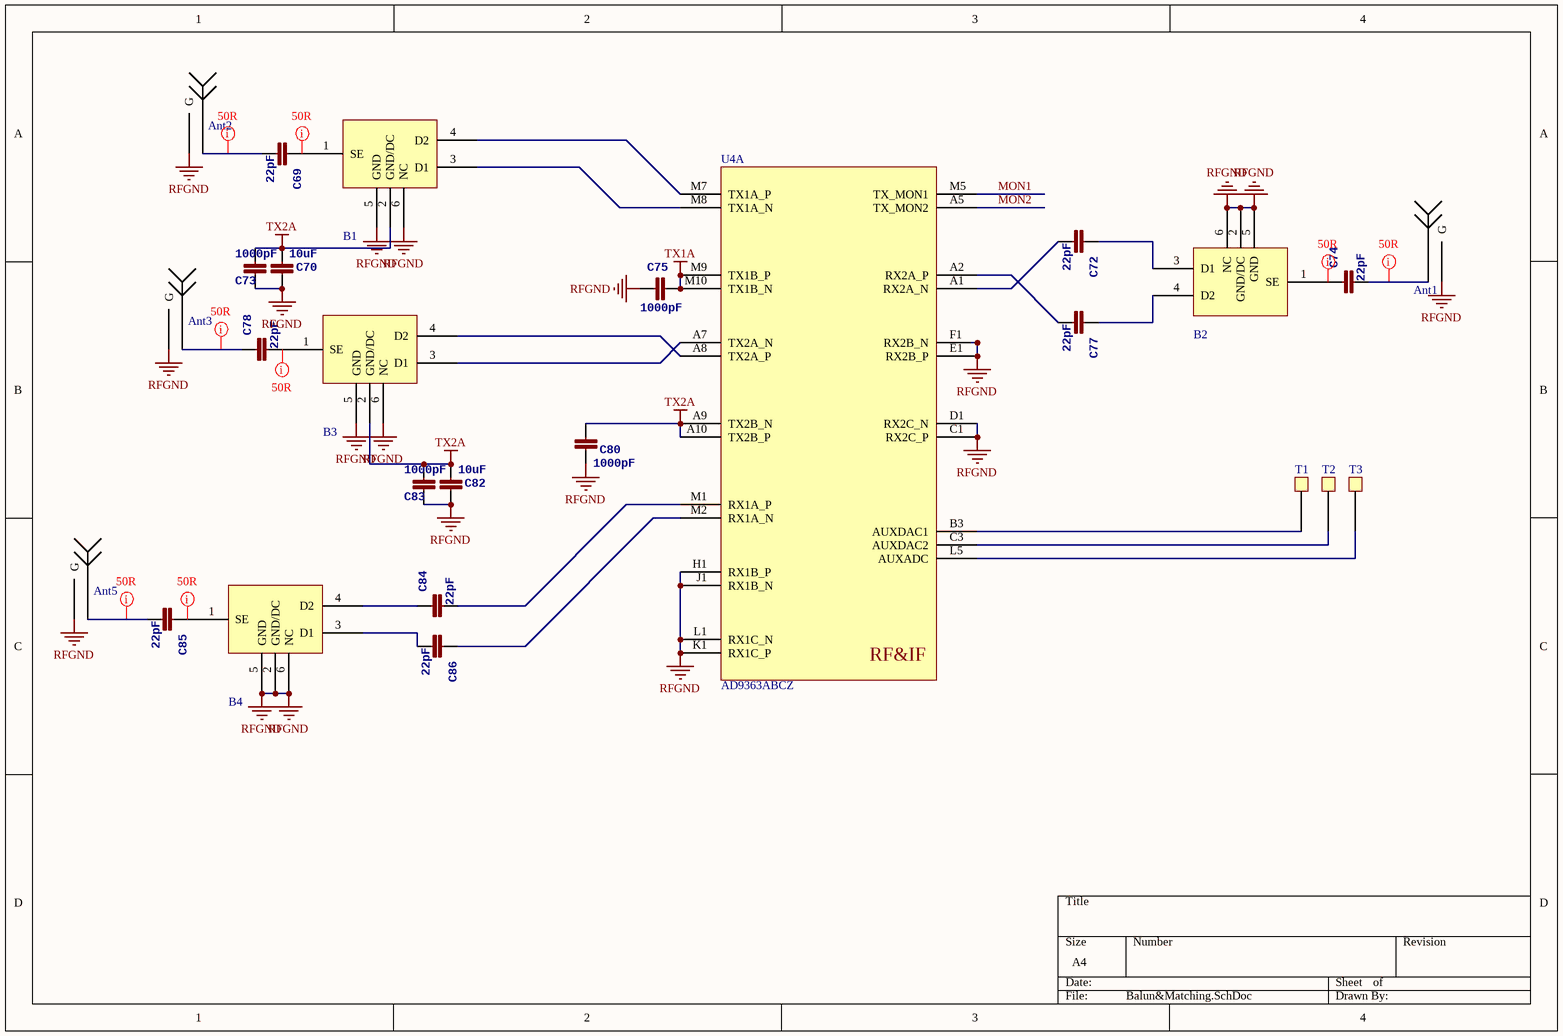
[diagram p5: Balun&Matching.SchDoc]

### Parts
Ant1  Antenna  [SMA-2]  (value not drawn)
Ant2  Antenna  [SMA-2]  (value not drawn)
Ant3  Antenna  [SMA-2]  (value not drawn)
Ant5  Antenna  [SMA-2]  (value not drawn)
B1  Balun  [HHM1711D1/HHM1732B1]  (value not drawn)
B2  Balun  [HHM1711D1/HHM1732B1]  (value not drawn)
B3  Balun  [HHM1711D1/HHM1732B1]  (value not drawn)
B4  Balun  [HHM1711D1/HHM1732B1]  (value not drawn)
C69  22pF  [0402]
C70  10uF  [0805]
C72  22pF  [0402]
C73  1000pF  [0402]
C74  22pF  [0402]
C75  1000pF  [0402]
C77  22pF  [0402]
C78  22pF  [0402]
C80  1000pF  [0402]
C82  10uF  [0805]
C83  1000pF  [0402]
C84  22pF  [0402]
C85  22pF  [0402]
C86  22pF  [0402]
T1  TestPad  [TestPad - 1mm]  (value not drawn)
T2  TestPad  [TestPad - 1mm]  (value not drawn)
T3  TestPad  [TestPad - 1mm]  (value not drawn)
U4  AD9363ABCZ  [AD936X]  (part A of 3)

### Nets
RFGND: Ant1.GND(G) Ant2.GND(G) Ant3.GND(G) Ant5.GND(G) B1.5(GND) B1.6(NC) B2.2(GND/DC) B2.5(GND) B2.6(NC) B3.5(GND) B3.6(NC) B4.2(GND/DC) B4.5(GND) B4.6(NC) C70.1 C73.2 C75.2 C80.2 C82.1 C83.2 U4.C1(RX2C_P) U4.D1(RX2C_N) U4.E1(RX2B_P) U4.F1(RX2B_N) U4.H1(RX1B_P) U4.J1(RX1B_N) U4.K1(RX1C_P) U4.L1(RX1C_N)
TX1A: B1.2(GND/DC) B3.2(GND/DC) C70.2 C73.1 C75.1 C80.1 C82.2 C83.1 U4.A9(TX2B_N) U4.A10(TX2B_P) U4.M9(TX1B_P) U4.M10(TX1B_N)  [also labelled TX2A]  [project net VDD_DIG]
MON1: U4.M5(TX_MON1)
MON2: U4.A5(TX_MON2)
NetAnt1_1: Ant1.1 C74.2
NetAnt2_1: Ant2.1 C69.2
NetAnt3_1: Ant3.1 C78.1
NetAnt5_1: Ant5.1 C85.2
NetB1_1: B1.1(SE) C69.1
NetB1_3: B1.3(D1) U4.M8(TX1A_N)
NetB1_4: B1.4(D2) U4.M7(TX1A_P)
NetB2_1: B2.1(SE) C74.1
NetB2_3: B2.3(D1) C72.1
NetB2_4: B2.4(D2) C77.1
NetB3_1: B3.1(SE) C78.2
NetB3_3: B3.3(D1) U4.A7(TX2A_N)
NetB3_4: B3.4(D2) U4.A8(TX2A_P)
NetB4_1: B4.1(SE) C85.1
NetB4_3: B4.3(D1) C86.2
NetB4_4: B4.4(D2) C84.1
NetC72_2: C72.2 U4.A1(RX2A_N)
NetC77_2: C77.2 U4.A2(RX2A_P)
NetC84_2: C84.2 U4.M1(RX1A_P)
NetC86_1: C86.1 U4.M2(RX1A_N)
NetT1_1: T1.1 U4.B3(AUXDAC1)
NetT2_1: T2.1 U4.C3(AUXDAC2)
NetT3_1: T3.1 U4.L5(AUXADC)

### Layout directives
net class 50R: NetAnt1_1, NetAnt2_1, NetAnt3_1, NetAnt5_1, NetB1_1, NetB2_1, NetB3_1, NetB4_1

### Notes on the sheet
- (in symbol AD9363ABCZ, part A) RF&IF

### Library data of the parts
C69 C70 C72-C75 C77 C78 C80 C82-C86 = CAP0402-CAP: as C8 on sheet power
U4 = AD9363ABCZ: Imported; Value: Value; Type: Type; RefDes: RefDes

## Sheet FPGA_IO_MCU.SchDoc
size A4
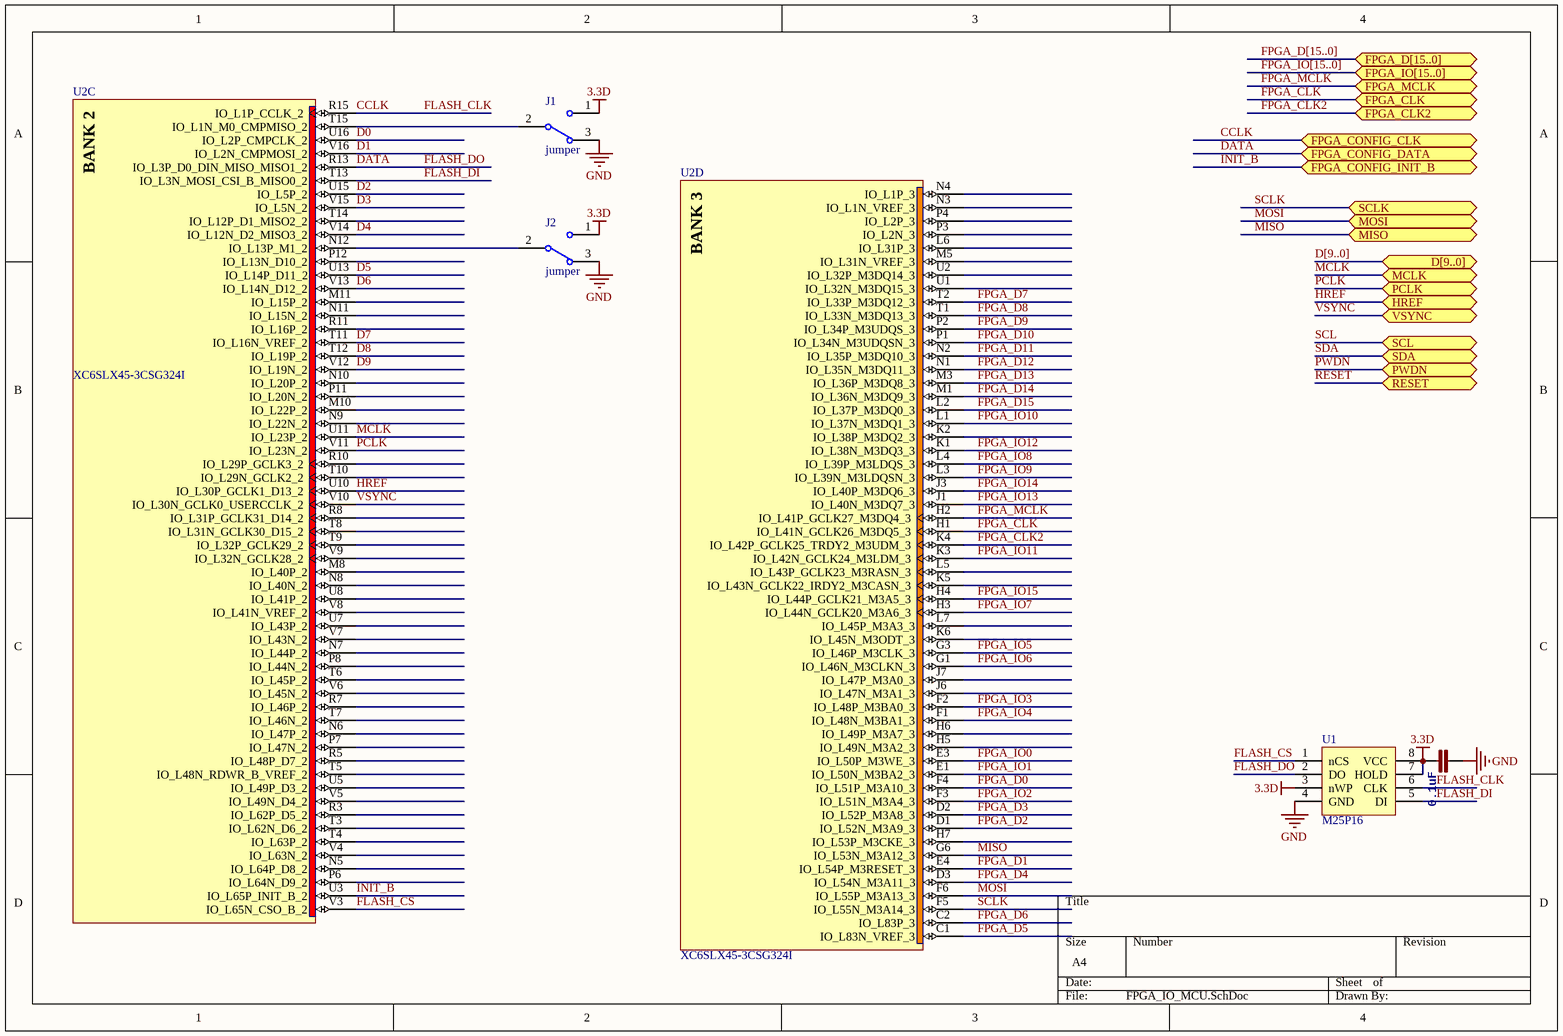
[diagram p6: FPGA_IO_MCU.SchDoc]

### Parts
C68  0.1uF  [0402]
J1  jumper  [0402J]
J2  jumper  [0402J]
U1  M25P16  [SO8]
U2  XC6SLX45-3CSG324I  [CSG324]  (parts C,D of 8)

### Ports
D[9..0], FPGA_CLK, FPGA_CLK2, FPGA_CONFIG_CLK, FPGA_CONFIG_DATA, FPGA_CONFIG_INIT_B, FPGA_D[15..0], FPGA_IO[15..0], FPGA_MCLK, HREF, MCLK, MISO, MOSI, PCLK, PWDN, RESET, SCL, SCLK, SDA, VSYNC

### Nets
3.3D: C68.2 J1.1 J2.1 U1.3(nWP) U1.7(HOLD) U1.8(VCC)
GND: C68.1 J1.3 J2.3 U1.4(GND)
CCLK: U1.6(CLK) U2.R15(IO_L1P_CCLK_2) ; port FPGA_CONFIG_CLK  [also labelled FLASH_CLK]
D0: U2.U16(IO_L2P_CMPCLK_2)
D1: U2.V16(IO_L2N_CMPMOSI_2)
D2: U2.U15(IO_L5P_2)
D3: U2.V15(IO_L5N_2)
D4: U2.V14(IO_L12N_D2_MISO3_2)
D5: U2.U13(IO_L14P_D11_2)
D6: U2.V13(IO_L14N_D12_2)
D7: U2.T11(IO_L16N_VREF_2)
D8: U2.T12(IO_L19P_2)
D9: U2.V12(IO_L19N_2)
DATA: U1.2(DO) U2.R13(IO_L3P_D0_DIN_MISO_MISO1_2) ; port FPGA_CONFIG_DATA  [also labelled FLASH_DO]
FLASH_CS: U1.1(nCS) U2.V3(IO_L65N_CSO_B_2)
FLASH_DI: U1.5(DI) U2.T13(IO_L3N_MOSI_CSI_B_MISO0_2)
FPGA_CLK: U2.H1(IO_L41N_GCLK26_M3DQ5_3) ; port FPGA_CLK
FPGA_CLK2: U2.K4(IO_L42P_GCLK25_TRDY2_M3UDM_3) ; port FPGA_CLK2
FPGA_D0: U2.F4(IO_L51P_M3A10_3)
FPGA_D1: U2.E4(IO_L54P_M3RESET_3)
FPGA_D2: U2.D1(IO_L52N_M3A9_3)
FPGA_D3: U2.D2(IO_L52P_M3A8_3)
FPGA_D4: U2.D3(IO_L54N_M3A11_3)
FPGA_D5: U2.C1(IO_L83N_VREF_3)
FPGA_D6: U2.C2(IO_L83P_3)
FPGA_D7: U2.T2(IO_L33P_M3DQ12_3)
FPGA_D8: U2.T1(IO_L33N_M3DQ13_3)
FPGA_D9: U2.P2(IO_L34P_M3UDQS_3)
FPGA_D10: U2.P1(IO_L34N_M3UDQSN_3)
FPGA_D11: U2.N2(IO_L35P_M3DQ10_3)
FPGA_D12: U2.N1(IO_L35N_M3DQ11_3)
FPGA_D13: U2.M3(IO_L36P_M3DQ8_3)
FPGA_D14: U2.M1(IO_L36N_M3DQ9_3)
FPGA_D15: U2.L2(IO_L37P_M3DQ0_3)
FPGA_IO0: U2.E3(IO_L50P_M3WE_3)
FPGA_IO1: U2.E1(IO_L50N_M3BA2_3)
FPGA_IO2: U2.F3(IO_L51N_M3A4_3)
FPGA_IO3: U2.F2(IO_L48P_M3BA0_3)
FPGA_IO4: U2.F1(IO_L48N_M3BA1_3)
FPGA_IO5: U2.G3(IO_L46P_M3CLK_3)
FPGA_IO6: U2.G1(IO_L46N_M3CLKN_3)
FPGA_IO7: U2.H3(IO_L44N_GCLK20_M3A6_3)
FPGA_IO8: U2.L4(IO_L39P_M3LDQS_3)
FPGA_IO9: U2.L3(IO_L39N_M3LDQSN_3)
FPGA_IO10: U2.L1(IO_L37N_M3DQ1_3)
FPGA_IO11: U2.K3(IO_L42N_GCLK24_M3LDM_3)
FPGA_IO12: U2.K1(IO_L38N_M3DQ3_3)
FPGA_IO13: U2.J1(IO_L40N_M3DQ7_3)
FPGA_IO14: U2.J3(IO_L40P_M3DQ6_3)
FPGA_IO15: U2.H4(IO_L44P_GCLK21_M3A5_3)
FPGA_MCLK: U2.H2(IO_L41P_GCLK27_M3DQ4_3) ; port FPGA_MCLK
HREF: U2.U10(IO_L30P_GCLK1_D13_2) ; port HREF
INIT_B: U2.U3(IO_L65P_INIT_B_2) ; port FPGA_CONFIG_INIT_B
MCLK: U2.U11(IO_L23P_2) ; port MCLK
MISO: U2.G6(IO_L53N_M3A12_3) ; port MISO
MOSI: U2.F6(IO_L55P_M3A13_3) ; port MOSI
PCLK: U2.V11(IO_L23N_2) ; port PCLK
SCLK: U2.F5(IO_L55N_M3A14_3) ; port SCLK
VSYNC: U2.V10(IO_L30N_GCLK0_USERCCLK_2) ; port VSYNC
NetJ1_2: J1.2 U2.T15(IO_L1N_M0_CMPMISO_2)
NetJ2_2: J2.2 U2.N12(IO_L13P_M1_2)

Not connected (* = marked no-connect by the designer): U2 H5(IO_L49N_M3A2_3) H6(IO_L49P_M3A7_3) H7(IO_L53P_M3CKE_3) J6(IO_L47N_M3A1_3) J7(IO_L47P_M3A0_3) K2(IO_L38P_M3DQ2_3) K5(IO_L43N_GCLK22_IRDY2_M3CASN_3) K6(IO_L45N_M3ODT_3) L5(IO_L43P_GCLK23_M3RASN_3) L6(IO_L31P_3) L7(IO_L45P_M3A3_3) M5(IO_L31N_VREF_3) M8(IO_L40P_2) M10(IO_L22P_2) M11(IO_L15P_2) N3(IO_L1N_VREF_3) N4(IO_L1P_3) N5(IO_L64P_D8_2) N6(IO_L47P_2) N7(IO_L44P_2) N8(IO_L40N_2) N9(IO_L22N_2) N10(IO_L20P_2) N11(IO_L15N_2) P3(IO_L2N_3) P4(IO_L2P_3) P6(IO_L64N_D9_2) P7(IO_L47N_2) P8(IO_L44N_2) P11(IO_L20N_2) P12(IO_L13N_D10_2) R3(IO_L62P_D5_2) R5(IO_L48P_D7_2) R7(IO_L46P_2) R8(IO_L31P_GCLK31_D14_2) R10(IO_L29P_GCLK3_2) R11(IO_L16P_2) T3(IO_L62N_D6_2) T4(IO_L63P_2) T5(IO_L48N_RDWR_B_VREF_2) T6(IO_L45P_2) T7(IO_L46N_2) T8(IO_L31N_GCLK30_D15_2) T9(IO_L32P_GCLK29_2) T10(IO_L29N_GCLK2_2) T14(IO_L12P_D1_MISO2_2) U1(IO_L32N_M3DQ15_3) U2(IO_L32P_M3DQ14_3) U5(IO_L49P_D3_2) U7(IO_L43P_2) U8(IO_L41P_2) V4(IO_L63N_2) V5(IO_L49N_D4_2) V6(IO_L45N_2) V7(IO_L43N_2) V8(IO_L41N_VREF_2) V9(IO_L32N_GCLK28_2)

### Buses and harness runs
bus D[9..0] = port D[9..0]
bus FPGA_D[15..0] = port FPGA_D[15..0]
bus FPGA_IO[15..0] = port FPGA_IO[15..0]

### Notes on the sheet
- (in symbol XC6SLX45-3CSG324I, part C) BANK 2
- (in symbol XC6SLX45-3CSG324I, part D) BANK 3

### Library data of the parts
C68 = CAP0402-CAP: as C8 on sheet power
J1 J2 = SW-SPDT: SPDT Subminiature Toggle Switch, Right Angle Mounting, Vertical Actuation; Published: 24-Mar-1999; LatestRevisionDate: 17-Dec-2003; LatestRevisionNote: Schematic revised, PCB Footprint replaced.; DatasheetVersion: 05-Dec-2000; PackageReference: TL36WW15050; Publisher: Altium Limited; PackageDescription: Switch; 4 Leads; ComponentLink1Description: Manufacturer Link; ComponentLink1URL: http://www.apem.com
U2 = XC6SLX45-3CSG324I: Spartan-6 LX 1.2V FPGA, 218 User I/Os, 324-Ball Chip-Scale BGA (0.8mm Pitch), Speed Grade 3, Industrial Grade, Pb-Free; Published: 17-Nov-2009; DatasheetVersion: ver1.6, Nov-2010; PackageVersion: ver1.1, Nov-2009; PackageReference: CSG324; Publisher: Altium Limited; PackageDescription: 324-Ball Chip-Scale BGA (CSG324) Package, 0.8 mm Pitch; Supplier 1: Digi-Key; Supplier Part Number 1: XC6SLX45-3CSG324I-ND; Code_JEDEC: MO-275-KKAC-1; ComponentLink1Description: Manufacturer Link; ComponentLink1URL: http://www.xilinx.com; ComponentLink2Description: Spartan-6 Datasheet; ComponentLink2URL: http://www.xilinx.com/support/documentation/data_sheets/ds160.pdf; ComponentLink3Description: Spartan-6 Documents; ComponentLink3URL: http://www.xilinx.com/support/documentation/spartan-6.htm; ComponentLink4Description: Xilinx.com Home; ComponentLink4URL: http://www.xilinx.com

## Sheet FPGA_Configuration_power.SchDoc
size A4
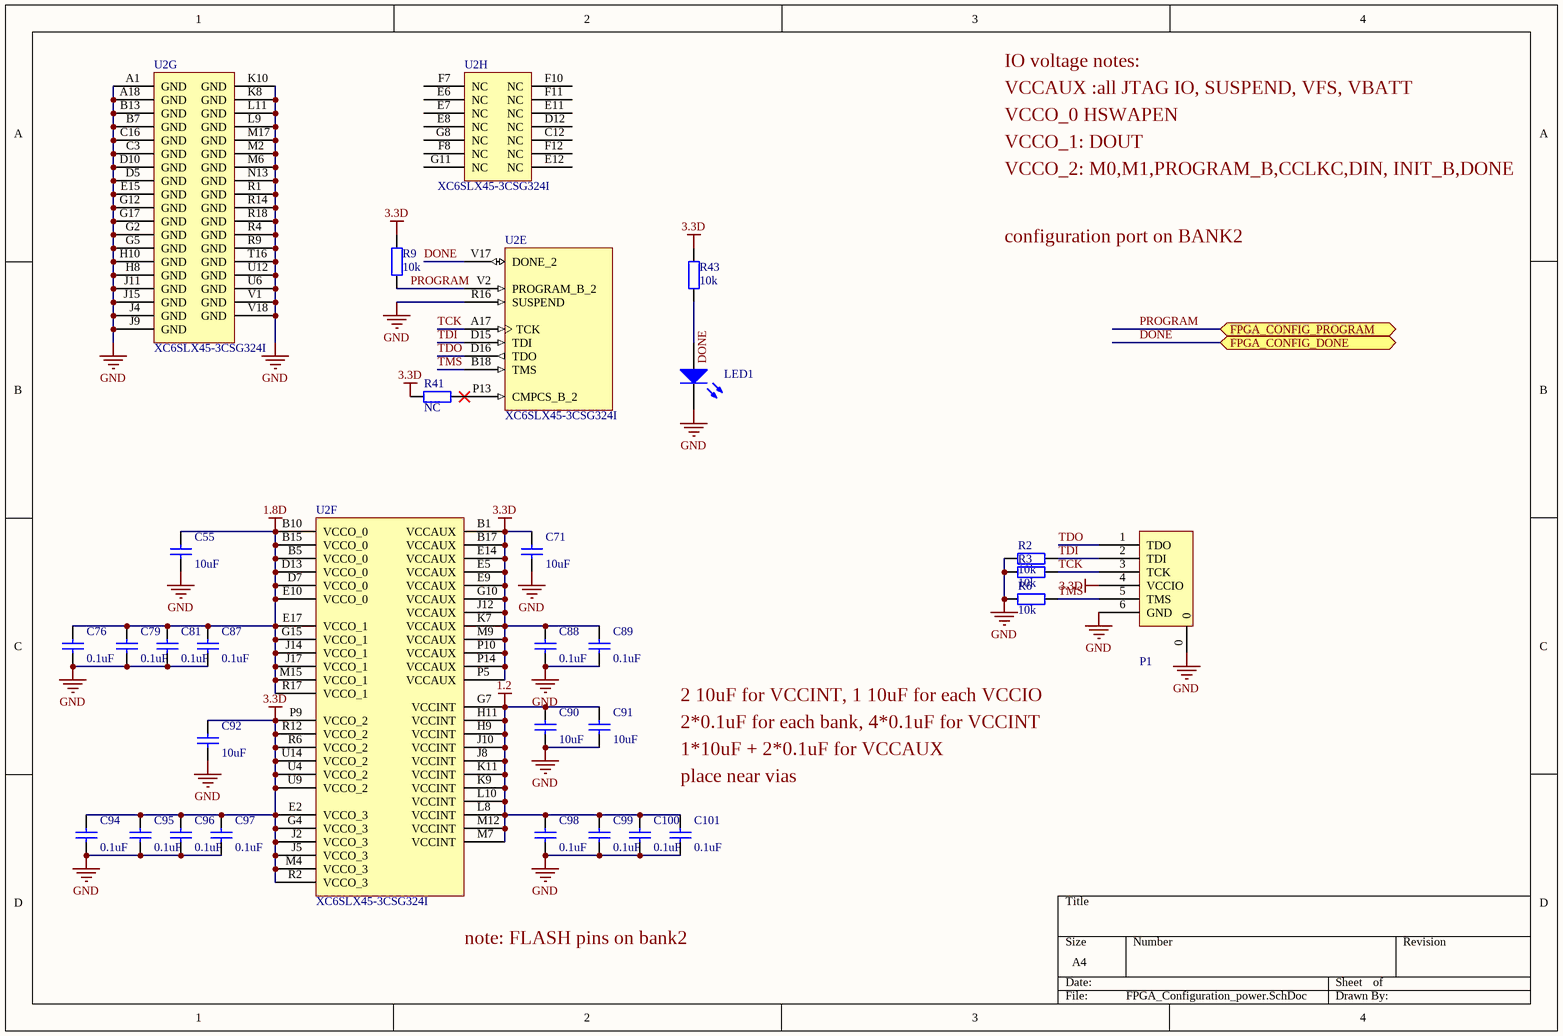
[diagram p7: FPGA_Configuration_power.SchDoc]

### Parts
C55  10uF  [0805]
C71  10uF  [0805]
C76  0.1uF  [0402]
C79  0.1uF  [0402]
C81  0.1uF  [0402]
C87  0.1uF  [0402]
C88  0.1uF  [0402]
C89  0.1uF  [0402]
C90  10uF  [0805]
C91  10uF  [0805]
C92  10uF  [0805]
C94  0.1uF  [0402]
C95  0.1uF  [0402]
C96  0.1uF  [0402]
C97  0.1uF  [0402]
C98  0.1uF  [0402]
C99  0.1uF  [0402]
C100  0.1uF  [0402]
C101  0.1uF  [0402]
LED1  LED0  [0603]  (value not drawn)
P1  JTAG-6P  [GH1.25-6]  (value not drawn)
R2  10k  [0402]
R3  10k  [0402]
R6  10k  [0402]
R9  10k  [0402]
R41  NC  [0402]
R43  10k  [0402]
U2  XC6SLX45-3CSG324I  [CSG324]  (parts E,F,G,H of 8)

### Ports
FPGA_CONFIG_DONE, FPGA_CONFIG_PROGRAM

### Nets
1.2: C90.1 C91.1 C98.1 C99.1 C100.1 C101.1 U2.G7(VCCINT) U2.H9(VCCINT) U2.H11(VCCINT) U2.J8(VCCINT) U2.J10(VCCINT) U2.K9(VCCINT) U2.K11(VCCINT) U2.L8(VCCINT) U2.L10(VCCINT) U2.M7(VCCINT) U2.M12(VCCINT)
1.8D: C55.1 C76.1 C79.1 C81.1 C87.1 U2.B5(VCCO_0) U2.B10(VCCO_0) U2.B15(VCCO_0) U2.D7(VCCO_0) U2.D13(VCCO_0) U2.E10(VCCO_0) U2.E17(VCCO_1) U2.G15(VCCO_1) U2.J14(VCCO_1) U2.J17(VCCO_1) U2.M15(VCCO_1) U2.R17(VCCO_1)
3.3D: C71.1 C88.1 C89.1 C92.1 C94.1 C95.1 C96.1 C97.1 P1.4(VCCIO) R9.1 R41.2 R43.1 U2.B1(VCCAUX) U2.B17(VCCAUX) U2.E2(VCCO_3) U2.E5(VCCAUX) U2.E9(VCCAUX) U2.E14(VCCAUX) U2.G4(VCCO_3) U2.G10(VCCAUX) U2.J2(VCCO_3) U2.J5(VCCO_3) U2.J12(VCCAUX) U2.K7(VCCAUX) U2.M4(VCCO_3) U2.M9(VCCAUX) U2.P5(VCCAUX) U2.P9(VCCO_2) U2.P10(VCCAUX) U2.P14(VCCAUX) U2.R2(VCCO_3) U2.R6(VCCO_2) U2.R12(VCCO_2) U2.U4(VCCO_2) U2.U9(VCCO_2) U2.U14(VCCO_2)
GND: C55.2 C71.2 C76.2 C79.2 C81.2 C87.2 C88.2 C89.2 C90.2 C91.2 C92.2 C94.2 C95.2 C96.2 C97.2 C98.2 C99.2 C100.2 C101.2 LED1.2(K) P1.0 P1.6(GND) R2.2 R3.2 R6.2 U2.A1(GND) U2.A18(GND) U2.B7(GND) U2.B13(GND) U2.C3(GND) U2.C16(GND) U2.D5(GND) U2.D10(GND) U2.E15(GND) U2.G2(GND) U2.G5(GND) U2.G12(GND) U2.G17(GND) U2.H8(GND) U2.H10(GND) U2.J4(GND) U2.J9(GND) U2.J11(GND) U2.J15(GND) U2.K8(GND) U2.K10(GND) U2.L9(GND) U2.L11(GND) U2.M2(GND) U2.M6(GND) U2.M17(GND) U2.N13(GND) U2.R1(GND) U2.R4(GND) U2.R9(GND) U2.R14(GND) U2.R16(SUSPEND) U2.R18(GND) U2.T16(GND) U2.U6(GND) U2.U12(GND) U2.V1(GND) U2.V18(GND)
DONE: LED1.1(A) R43.2 U2.V17(DONE_2) ; port FPGA_CONFIG_DONE
PROGRAM: R9.2 U2.V2(PROGRAM_B_2) ; port FPGA_CONFIG_PROGRAM
TCK: P1.3(TCK) R3.1 U2.A17(TCK)
TDI: P1.2(TDI) R2.1 U2.D15(TDI)
TDO: P1.1(TDO) U2.D16(TDO)
TMS: P1.5(TMS) R6.1 U2.B18(TMS)
NetR41_1: R41.1 U2.P13(CMPCS_B_2)

Not connected (* = marked no-connect by the designer): U2 C12(NC) D12(NC) E6(NC) E7(NC) E8(NC) E11(NC) E12(NC) F7(NC) F8(NC) F10(NC) F11(NC) F12(NC) G8(NC) G11(NC)

### Notes on the sheet
- VCCAUX :all JTAG IO, SUSPEND, VFS, VBATT
- IO voltage notes:
- VCCO_0 HSWAPEN
- VCCO_1: DOUT
- VCCO_2: M0,M1,PROGRAM_B,CCLKC,DIN, INIT_B,DONE
- configuration port on BANK2
- 2 10uF for VCCINT, 1 10uF for each VCCIO
- 2*0.1uF for each bank, 4*0.1uF for VCCINT
- 1*10uF + 2*0.1uF for VCCAUX
- place near vias
- (near U2) note: FLASH pins on bank2

### Library data of the parts
C55 C71 C76 C79 C81 C87-C92 C94-C101 = Cap: Capacitor; Published: 8-Jun-2000; LatestRevisionDate: 17-Jul-2002; LatestRevisionNote: Re-released for DXP Platform.; PackageReference: RAD-0.3; Publisher: Altium Limited; PackageDescription: Radial Cap, Thru-Hole; 2 Leads; 0.3 in Pin Spacing
LED1 = LED0: Typical INFRARED GaAs LED; Published: 8-Jun-2000; LatestRevisionDate: 08-Jul-2005; LatestRevisionNote: Mech Layer 1 removed.; PackageReference: LED-0; Publisher: Altium Limited; PackageDescription: LED; 2 Leads
R2 R3 R6 R9 R41 R43 = Res2: Resistor; Published: 8-Jun-2000; LatestRevisionDate: 17-Jul-2002; LatestRevisionNote: Re-released for DXP Platform.; PackageReference: AXIAL-0.4; Publisher: Altium Limited; PackageDescription: Axial Device, Thru-Hole; 2 Leads; 0.4 in Pin Spacing
U2 = XC6SLX45-3CSG324I: as U2 on sheet FPGA_IO_MCU; Published: 17-Nov-2009; DatasheetVersion: ver1.6, Nov-2010; PackageVersion: ver1.1, Nov-2009; PackageReference: CSG324; Publisher: Altium Limited; PackageDescription: 324-Ball Chip-Scale BGA (CSG324) Package, 0.8 mm Pitch; Supplier 1: Digi-Key; Supplier Part Number 1: XC6SLX45-3CSG324I-ND; Code_JEDEC: MO-275-KKAC-1; ComponentLink1Description: Manufacturer Link; ComponentLink1URL: http://www.xilinx.com; ComponentLink2Description: Spartan-6 Datasheet; ComponentLink2URL: http://www.xilinx.com/support/documentation/data_sheets/ds160.pdf; ComponentLink3Description: Spartan-6 Documents; ComponentLink3URL: http://www.xilinx.com/support/documentation/spartan-6.htm; ComponentLink4Description: Xilinx.com Home; ComponentLink4URL: http://www.xilinx.com

## Sheet FPGA_IO_Transceiver.SchDoc
size A4
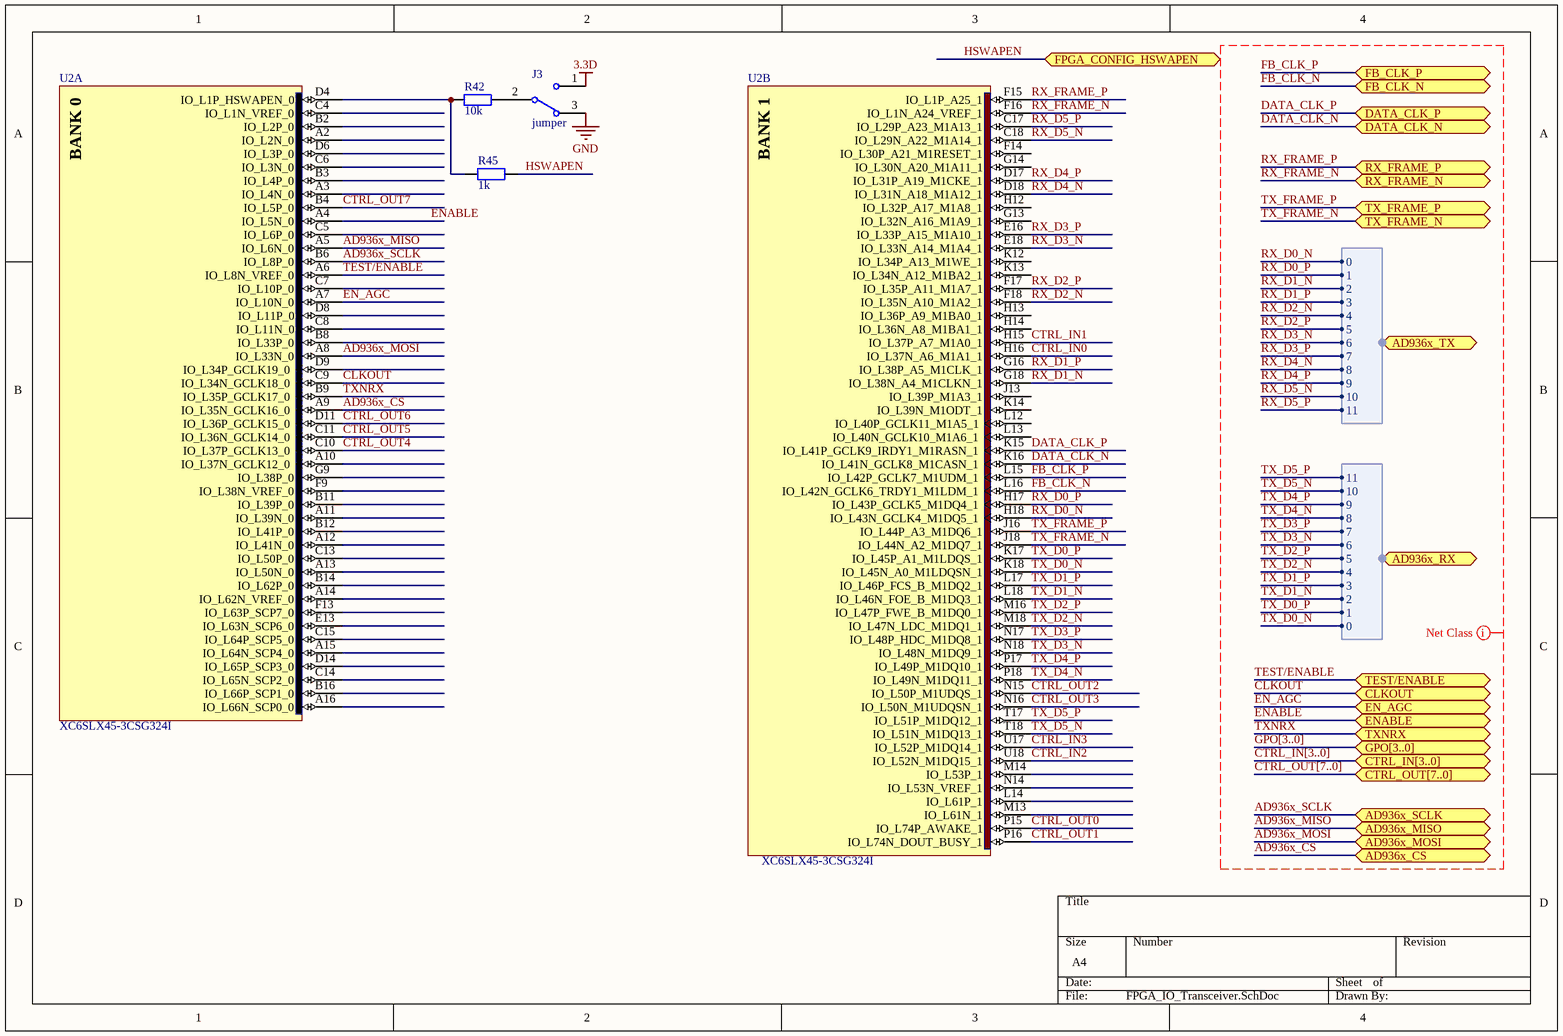
[diagram p8: FPGA_IO_Transceiver.SchDoc]

### Parts
J3  jumper  [0402J]
R42  10k  [0402]
R45  1k  [0402]
U2  XC6SLX45-3CSG324I  [CSG324]  (parts A,B of 8)

### Ports
AD936x_CS, AD936x_MISO, AD936x_MOSI, AD936x_RX (harness Harness), AD936x_SCLK, AD936x_TX (harness Harness), CLKOUT, CTRL_IN[3..0], CTRL_OUT[7..0], DATA_CLK_N, DATA_CLK_P, EN_AGC, ENABLE, FB_CLK_N, FB_CLK_P, FPGA_CONFIG_HSWAPEN, GPO[3..0], RX_FRAME_N, RX_FRAME_P, TEST/ENABLE, TX_FRAME_N, TX_FRAME_P, TXNRX

### Harnesses
Harness: 0, 1, 2, 3, 4, 5, 6, 7, 8, 9, 10, 11

### Nets
3.3D: J3.1
GND: J3.3
AD936x_CS: U2.A9(IO_L35N_GCLK16_0) ; port AD936x_CS
AD936x_MISO: U2.A5(IO_L6N_0) ; port AD936x_MISO
AD936x_MOSI: U2.A8(IO_L33N_0) ; port AD936x_MOSI
AD936x_SCLK: U2.B6(IO_L8P_0) ; port AD936x_SCLK
CLKOUT: U2.C9(IO_L34N_GCLK18_0) ; port CLKOUT
CTRL_IN0: U2.H16(IO_L37N_A6_M1A1_1)
CTRL_IN1: U2.H15(IO_L37P_A7_M1A0_1)
CTRL_IN2: U2.U18(IO_L52N_M1DQ15_1)
CTRL_IN3: U2.U17(IO_L52P_M1DQ14_1)
CTRL_OUT0: U2.P15(IO_L74P_AWAKE_1)
CTRL_OUT1: U2.P16(IO_L74N_DOUT_BUSY_1)
CTRL_OUT2: U2.N15(IO_L50P_M1UDQS_1)
CTRL_OUT3: U2.N16(IO_L50N_M1UDQSN_1)
CTRL_OUT4: U2.C10(IO_L37P_GCLK13_0)
CTRL_OUT5: U2.C11(IO_L36N_GCLK14_0)
CTRL_OUT6: U2.D11(IO_L36P_GCLK15_0)
CTRL_OUT7: U2.B4(IO_L5P_0)
DATA_CLK_N: U2.K16(IO_L41N_GCLK8_M1CASN_1) ; port DATA_CLK_N
DATA_CLK_P: U2.K15(IO_L41P_GCLK9_IRDY1_M1RASN_1) ; port DATA_CLK_P
EN_AGC: U2.A7(IO_L10N_0) ; port EN_AGC
ENABLE: U2.A4(IO_L5N_0) ; port ENABLE
FB_CLK_N: U2.L16(IO_L42N_GCLK6_TRDY1_M1LDM_1) ; port FB_CLK_N
FB_CLK_P: U2.L15(IO_L42P_GCLK7_M1UDM_1) ; port FB_CLK_P
HSWAPEN: R45.1 ; port FPGA_CONFIG_HSWAPEN  [project net _HSWAPEN]
RX_D0_N: U2.H18(IO_L43N_GCLK4_M1DQ5_1) ; port AD936x_TX.0
RX_D0_P: U2.H17(IO_L43P_GCLK5_M1DQ4_1) ; port AD936x_TX.1
RX_D1_N: U2.G18(IO_L38N_A4_M1CLKN_1) ; port AD936x_TX.2
RX_D1_P: U2.G16(IO_L38P_A5_M1CLK_1) ; port AD936x_TX.3
RX_D2_N: U2.F18(IO_L35N_A10_M1A2_1) ; port AD936x_TX.4
RX_D2_P: U2.F17(IO_L35P_A11_M1A7_1) ; port AD936x_TX.5
RX_D3_N: U2.E18(IO_L33N_A14_M1A4_1) ; port AD936x_TX.6
RX_D3_P: U2.E16(IO_L33P_A15_M1A10_1) ; port AD936x_TX.7
RX_D4_N: U2.D18(IO_L31N_A18_M1A12_1) ; port AD936x_TX.8
RX_D4_P: U2.D17(IO_L31P_A19_M1CKE_1) ; port AD936x_TX.9
RX_D5_N: U2.C18(IO_L29N_A22_M1A14_1) ; port AD936x_TX.10
RX_D5_P: U2.C17(IO_L29P_A23_M1A13_1) ; port AD936x_TX.11
RX_FRAME_N: U2.F16(IO_L1N_A24_VREF_1) ; port RX_FRAME_N
RX_FRAME_P: U2.F15(IO_L1P_A25_1) ; port RX_FRAME_P
TEST/ENABLE: U2.A6(IO_L8N_VREF_0) ; port TEST/ENABLE
TX_D0_N: U2.K18(IO_L45N_A0_M1LDQSN_1) ; port AD936x_RX.0
TX_D0_P: U2.K17(IO_L45P_A1_M1LDQS_1) ; port AD936x_RX.1
TX_D1_N: U2.L18(IO_L46N_FOE_B_M1DQ3_1) ; port AD936x_RX.2
TX_D1_P: U2.L17(IO_L46P_FCS_B_M1DQ2_1) ; port AD936x_RX.3
TX_D2_N: U2.M18(IO_L47N_LDC_M1DQ1_1) ; port AD936x_RX.4
TX_D2_P: U2.M16(IO_L47P_FWE_B_M1DQ0_1) ; port AD936x_RX.5
TX_D3_N: U2.N18(IO_L48N_M1DQ9_1) ; port AD936x_RX.6
TX_D3_P: U2.N17(IO_L48P_HDC_M1DQ8_1) ; port AD936x_RX.7
TX_D4_N: U2.P18(IO_L49N_M1DQ11_1) ; port AD936x_RX.8
TX_D4_P: U2.P17(IO_L49P_M1DQ10_1) ; port AD936x_RX.9
TX_D5_N: U2.T18(IO_L51N_M1DQ13_1) ; port AD936x_RX.10
TX_D5_P: U2.T17(IO_L51P_M1DQ12_1) ; port AD936x_RX.11
TX_FRAME_N: U2.J18(IO_L44N_A2_M1DQ7_1) ; port TX_FRAME_N
TX_FRAME_P: U2.J16(IO_L44P_A3_M1DQ6_1) ; port TX_FRAME_P
TXNRX: U2.B9(IO_L35P_GCLK17_0) ; port TXNRX
NetJ3_2: J3.2 R42.1
NetR42_2: R42.2 R45.2 U2.D4(IO_L1P_HSWAPEN_0)

Not connected (* = marked no-connect by the designer): U2 A2(IO_L2N_0) A3(IO_L4N_0) A10(IO_L37N_GCLK12_0) A11(IO_L39N_0) A12(IO_L41N_0) A13(IO_L50N_0) A14(IO_L62N_VREF_0) A15(IO_L64N_SCP4_0) A16(IO_L66N_SCP0_0) B2(IO_L2P_0) B3(IO_L4P_0) B8(IO_L33P_0) B11(IO_L39P_0) B12(IO_L41P_0) B14(IO_L62P_0) B16(IO_L66P_SCP1_0) C4(IO_L1N_VREF_0) C5(IO_L6P_0) C6(IO_L3N_0) C7(IO_L10P_0) C8(IO_L11N_0) C13(IO_L50P_0) C14(IO_L65N_SCP2_0) C15(IO_L64P_SCP5_0) D6(IO_L3P_0) D8(IO_L11P_0) D9(IO_L34P_GCLK19_0) D14(IO_L65P_SCP3_0) E13(IO_L63N_SCP6_0) F9(IO_L38N_VREF_0) F13(IO_L63P_SCP7_0) F14(IO_L30P_A21_M1RESET_1) G9(IO_L38P_0) G13(IO_L32N_A16_M1A9_1) G14(IO_L30N_A20_M1A11_1) H12(IO_L32P_A17_M1A8_1) H13(IO_L36P_A9_M1BA0_1) H14(IO_L36N_A8_M1BA1_1) J13(IO_L39P_M1A3_1) K12(IO_L34P_A13_M1WE_1) K13(IO_L34N_A12_M1BA2_1) K14(IO_L39N_M1ODT_1) L12(IO_L40P_GCLK11_M1A5_1) L13(IO_L40N_GCLK10_M1A6_1) L14(IO_L61P_1) M13(IO_L61N_1) M14(IO_L53P_1) N14(IO_L53N_VREF_1)

### Buses and harness runs
bus CTRL_IN[3..0] = port CTRL_IN[3..0]
bus CTRL_OUT[7..0] = port CTRL_OUT[7..0]
bus GPO[3..0] = port GPO[3..0]

### Layout directives
net class tranciver: AD936x_CS, AD936x_MISO, AD936x_MOSI, AD936x_SCLK, CLKOUT, CTRL_IN[3..0], CTRL_OUT[7..0], DATA_CLK_N, DATA_CLK_P, EN_AGC, ENABLE, FB_CLK_N, FB_CLK_P, GPO[3..0], RX_D0_N, RX_D0_P, RX_D1_N, RX_D1_P, RX_D2_N, RX_D2_P, RX_D3_N, RX_D3_P, RX_D4_N, RX_D4_P, RX_D5_N, RX_D5_P, RX_FRAME_N, RX_FRAME_P, TEST/ENABLE, TX_D0_N, TX_D0_P, TX_D1_N, TX_D1_P, TX_D2_N, TX_D2_P, TX_D3_N, TX_D3_P, TX_D4_N, TX_D4_P, TX_D5_N, TX_D5_P, TX_FRAME_N, TX_FRAME_P, TXNRX

### Notes on the sheet
- (in symbol XC6SLX45-3CSG324I, part A) BANK 0
- (in symbol XC6SLX45-3CSG324I, part B) BANK 1

### Library data of the parts
J3 = SW-SPDT: as J1 on sheet FPGA_IO_MCU; Published: 24-Mar-1999; LatestRevisionDate: 17-Dec-2003; LatestRevisionNote: Schematic revised, PCB Footprint replaced.; DatasheetVersion: 05-Dec-2000; PackageReference: TL36WW15050; Publisher: Altium Limited; PackageDescription: Switch; 4 Leads; ComponentLink1Description: Manufacturer Link; ComponentLink1URL: http://www.apem.com
R42 R45 = Res2: Resistor; Published: 8-Jun-2000; LatestRevisionDate: 17-Jul-2002; LatestRevisionNote: Re-released for DXP Platform.; PackageReference: AXIAL-0.4; Publisher: Altium Limited; PackageDescription: Axial Device, Thru-Hole; 2 Leads; 0.4 in Pin Spacing
U2 = XC6SLX45-3CSG324I: as U2 on sheet FPGA_IO_MCU; Published: 17-Nov-2009; DatasheetVersion: ver1.6, Nov-2010; PackageVersion: ver1.1, Nov-2009; PackageReference: CSG324; Publisher: Altium Limited; PackageDescription: 324-Ball Chip-Scale BGA (CSG324) Package, 0.8 mm Pitch; Supplier 1: Digi-Key; Supplier Part Number 1: XC6SLX45-3CSG324I-ND; Code_JEDEC: MO-275-KKAC-1; ComponentLink1Description: Manufacturer Link; ComponentLink1URL: http://www.xilinx.com; ComponentLink2Description: Spartan-6 Datasheet; ComponentLink2URL: http://www.xilinx.com/support/documentation/data_sheets/ds160.pdf; ComponentLink3Description: Spartan-6 Documents; ComponentLink3URL: http://www.xilinx.com/support/documentation/spartan-6.htm; ComponentLink4Description: Xilinx.com Home; ComponentLink4URL: http://www.xilinx.com

## Sheet camera.SchDoc
size A4
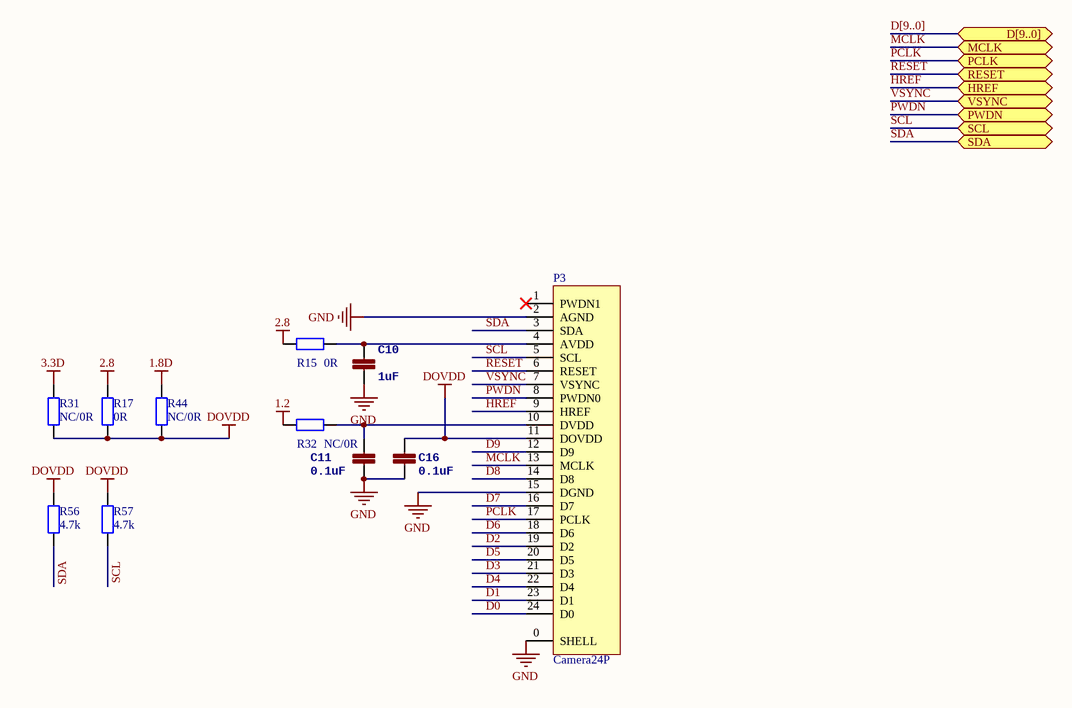
[diagram p9: camera.SchDoc]

### Parts
C10  1uF  [0402]
C11  0.1uF  [0402]
C16  0.1uF  [0402]
P3  Camera24P  [FPC-0.5mm-24]
R15  0R  [0402]
R17  0R  [0402]
R31  NC/0R  [0402]
R32  NC/0R  [0402]
R44  NC/0R  [0402]
R56  4.7k  [0402]
R57  4.7k  [0402]

### Ports
D[9..0], HREF, MCLK, PCLK, PWDN, RESET, SCL, SDA, VSYNC

### Nets
1.2: R32.2
1.8D: R44.1
2.8: R15.2 R17.1
3.3D: R31.1
DOVDD: C16.2 P3.11(DOVDD) R17.2 R31.2 R44.2 R56.1 R57.1
GND: C10.1 C11.1 C16.1 P3.0(SHELL) P3.2(AGND) P3.15(DGND)
D0: P3.24(D0)
D1: P3.23(D1)
D2: P3.19(D2)
D3: P3.21(D3)
D4: P3.22(D4)
D5: P3.20(D5)
D6: P3.18(D6)
D7: P3.16(D7)
D8: P3.14(D8)
D9: P3.12(D9)
HREF: P3.9(HREF) ; port HREF
MCLK: P3.13(MCLK) ; port MCLK
PCLK: P3.17(PCLK) ; port PCLK
PWDN: P3.8(PWDN0) ; port PWDN
RESET: P3.6(RESET) ; port RESET
SCL: P3.5(SCL) R57.2 ; port SCL
SDA: P3.3(SDA) R56.2 ; port SDA
VSYNC: P3.7(VSYNC) ; port VSYNC
NetC10_2: C10.2 P3.4(AVDD) R15.1
NetC11_2: C11.2 P3.10(DVDD) R32.1

Not connected (* = marked no-connect by the designer): P3 1(PWDN1)*

### Buses and harness runs
bus D[9..0] = port D[9..0]

### Library data of the parts
C10 C11 C16 = CAP0402-CAP: as C8 on sheet power
R15 R17 R31 R32 R44 R56 R57 = Res2: Resistor; Value: 0Ohm; Published: 8-Jun-2000; LatestRevisionDate: 17-Jul-2002; LatestRevisionNote: Re-released for DXP Platform.; PackageReference: AXIAL-0.4; Publisher: Altium Limited; PackageDescription: Axial Device, Thru-Hole; 2 Leads; 0.4 in Pin Spacing

## Nets that join several sheets
1.2: power (C3.2 L1.2 R5.1 U5.4), FPGA_Configuration_power (17 pins), camera (R32.2)
1.3A: power (7 pins), AD936X (R36.1)
1.3B: power (7 pins), AD936X (R37.1)
1.8D: power (C31.1 C32.2 L4.2 R12.1), AD936X (C48.1 R40.2 U4.H12), FPGA_Configuration_power (17 pins), camera (R44.1)
2.8: power (C45.2 T16.1 U7.5), camera (R15.2 R17.1)
3.3D: power (5 pins), USB_HS_PHY (7 pins), AD936X (R19.2), mcu2 (27 pins), FPGA_IO_MCU (6 pins), FPGA_Configuration_power (36 pins), FPGA_IO_Transceiver (J3.1), camera (R31.1)
3.3OSC: power (C102.2 U12.5), AD936X (C93.1 X1.4)
5V: power (21 pins), USB_HS_PHY (R46.1 R60.1), mcu2 (R48.1)
GND: power (39 pins), USB_HS_PHY (12 pins), AD936X (12 pins), mcu2 (50 pins), FPGA_IO_MCU (C68.1 J1.3 J2.3 U1.4), FPGA_Configuration_power (63 pins), FPGA_IO_Transceiver (J3.3), camera (6 pins)
RFGND: power (17 pins), AD936X (58 pins), Balun&Matching (28 pins)
V1.32: power (C7.2 L3.2 R1.1 U3.4), mcu2 (R28.2 R33.2)
VDD_DIG: AD936X (13 pins), Balun&Matching (12 pins)
_HSWAPEN: mcu2 (U11.C15), FPGA_IO_Transceiver (R45.1)
AD936x_CS: AD936X (U4.K6), FPGA_IO_Transceiver (U2.A9)
AD936x_MISO: AD936X (U4.L6), FPGA_IO_Transceiver (U2.A5)
AD936x_MOSI: AD936X (U4.J4), FPGA_IO_Transceiver (U2.A8)
AD936x_SCLK: AD936X (U4.J5), FPGA_IO_Transceiver (U2.B6)
CCLK: mcu2 (U11.A10), FPGA_IO_MCU (U1.6 U2.R15)
CLK_24M: USB_HS_PHY (C108.2 R61.2 U9.27 X2.3), mcu2 (C15.2)
CLKOUT: AD936X (U4.J6), FPGA_IO_Transceiver (U2.C9)
CTRL_IN0: AD936X (U4.C5), FPGA_IO_Transceiver (U2.H16)
CTRL_IN1: AD936X (U4.C6), FPGA_IO_Transceiver (U2.H15)
CTRL_IN2: AD936X (U4.D6), FPGA_IO_Transceiver (U2.U18)
CTRL_IN3: AD936X (U4.D5), FPGA_IO_Transceiver (U2.U17)
CTRL_OUT0: AD936X (U4.D4), FPGA_IO_Transceiver (U2.P15)
CTRL_OUT1: AD936X (U4.E4), FPGA_IO_Transceiver (U2.P16)
CTRL_OUT2: AD936X (U4.E5), FPGA_IO_Transceiver (U2.N15)
CTRL_OUT3: AD936X (U4.E6), FPGA_IO_Transceiver (U2.N16)
CTRL_OUT4: AD936X (U4.F6), FPGA_IO_Transceiver (U2.C10)
CTRL_OUT5: AD936X (U4.F5), FPGA_IO_Transceiver (U2.C11)
CTRL_OUT6: AD936X (U4.F4), FPGA_IO_Transceiver (U2.D11)
CTRL_OUT7: AD936X (U4.G4), FPGA_IO_Transceiver (U2.B4)
D0: FPGA_IO_MCU (U2.U16), camera (P3.24)
D1: FPGA_IO_MCU (U2.V16), camera (P3.23)
D2: FPGA_IO_MCU (U2.U15), camera (P3.19)
D3: FPGA_IO_MCU (U2.V15), camera (P3.21)
D4: FPGA_IO_MCU (U2.V14), camera (P3.22)
D5: FPGA_IO_MCU (U2.U13), camera (P3.20)
D6: FPGA_IO_MCU (U2.V13), camera (P3.18)
D7: FPGA_IO_MCU (U2.T11), camera (P3.16)
D8: FPGA_IO_MCU (U2.T12), camera (P3.14)
D9: FPGA_IO_MCU (U2.V12), camera (P3.12)
DATA: mcu2 (U11.R3), FPGA_IO_MCU (U1.2 U2.R13)
DATA_CLK_N: AD936X (U4.H11), FPGA_IO_Transceiver (U2.K16)
DATA_CLK_P: AD936X (U4.G11), FPGA_IO_Transceiver (U2.K15)
EN_AGC: AD936X (U4.G5), FPGA_IO_Transceiver (U2.A7)
ENABLE: AD936X (U4.G6), FPGA_IO_Transceiver (U2.A4)
FB_CLK_N: AD936X (U4.G10), FPGA_IO_Transceiver (U2.L16)
FB_CLK_P: AD936X (U4.F10), FPGA_IO_Transceiver (U2.L15)
FPGA_CLK: mcu2 (U11.F15), FPGA_IO_MCU (U2.H1)
FPGA_CLK2: mcu2 (U11.E15), FPGA_IO_MCU (U2.K4)
FPGA_D0: mcu2 (U11.A4), FPGA_IO_MCU (U2.F4)
FPGA_D1: mcu2 (U11.A3), FPGA_IO_MCU (U2.E4)
FPGA_D2: mcu2 (U11.A2), FPGA_IO_MCU (U2.D1)
FPGA_D3: mcu2 (U11.A1), FPGA_IO_MCU (U2.D2)
FPGA_D4: mcu2 (U11.B1), FPGA_IO_MCU (U2.D3)
FPGA_D5: mcu2 (U11.B2), FPGA_IO_MCU (U2.C1)
FPGA_D6: mcu2 (U11.B3), FPGA_IO_MCU (U2.C2)
FPGA_D7: mcu2 (U11.R8), FPGA_IO_MCU (U2.T2)
FPGA_D8: mcu2 (U11.P8), FPGA_IO_MCU (U2.T1)
FPGA_D9: mcu2 (U11.P9), FPGA_IO_MCU (U2.P2)
FPGA_D10: mcu2 (U11.R9), FPGA_IO_MCU (U2.P1)
FPGA_D11: mcu2 (U11.P10), FPGA_IO_MCU (U2.N2)
FPGA_D12: mcu2 (U11.R10), FPGA_IO_MCU (U2.N1)
FPGA_D13: mcu2 (U11.N11), FPGA_IO_MCU (U2.M3)
FPGA_D14: mcu2 (U11.P11), FPGA_IO_MCU (U2.M1)
FPGA_D15: mcu2 (U11.R11), FPGA_IO_MCU (U2.L2)
FPGA_IO0: mcu2 (U11.B12), FPGA_IO_MCU (U2.E3)
FPGA_IO1: mcu2 (U11.C12), FPGA_IO_MCU (U2.E1)
FPGA_IO2: mcu2 (U11.D12), FPGA_IO_MCU (U2.F3)
FPGA_IO3: mcu2 (U11.D11), FPGA_IO_MCU (U2.F2)
FPGA_IO4: mcu2 (U11.D10), FPGA_IO_MCU (U2.F1)
FPGA_IO5: mcu2 (U11.C11), FPGA_IO_MCU (U2.G3)
FPGA_IO6: mcu2 (U11.B11), FPGA_IO_MCU (U2.G1)
FPGA_IO7: mcu2 (U11.A11), FPGA_IO_MCU (U2.H3)
FPGA_IO8: mcu2 (U11.P15), FPGA_IO_MCU (U2.L4)
FPGA_IO9: mcu2 (U11.P14), FPGA_IO_MCU (U2.L3)
FPGA_IO10: mcu2 (U11.N15), FPGA_IO_MCU (U2.L1)
FPGA_IO11: mcu2 (U11.N14), FPGA_IO_MCU (U2.K3)
FPGA_IO12: mcu2 (U11.N13), FPGA_IO_MCU (U2.K1)
FPGA_IO13: mcu2 (U11.M15), FPGA_IO_MCU (U2.J1)
FPGA_IO14: mcu2 (U11.M14), FPGA_IO_MCU (U2.J3)
FPGA_IO15: mcu2 (U11.L14), FPGA_IO_MCU (U2.H4)
FPGA_MCLK: mcu2 (U11.F14), FPGA_IO_MCU (U2.H2)
HREF: FPGA_IO_MCU (U2.U10), camera (P3.9)
INIT_B: mcu2 (U11.D15), FPGA_IO_MCU (U2.U3)
MCLK: FPGA_IO_MCU (U2.U11), camera (P3.13)
MISO: mcu2 (U11.B13), FPGA_IO_MCU (U2.G6)
MOSI: mcu2 (U11.A12), FPGA_IO_MCU (U2.F6)
PCLK: FPGA_IO_MCU (U2.V11), camera (P3.17)
PWDN: mcu2 (U11.R7), camera (P3.8)
RESET: mcu2 (U11.R6), camera (P3.6)
RX_D0_N: AD936X (U4.K11), FPGA_IO_Transceiver (U2.H18)
RX_D0_P: AD936X (U4.J12), FPGA_IO_Transceiver (U2.H17)
RX_D1_N: AD936X (U4.K10), FPGA_IO_Transceiver (U2.G18)
RX_D1_P: AD936X (U4.J11), FPGA_IO_Transceiver (U2.G16)
RX_D2_N: AD936X (U4.K9), FPGA_IO_Transceiver (U2.F18)
RX_D2_P: AD936X (U4.J10), FPGA_IO_Transceiver (U2.F17)
RX_D3_N: AD936X (U4.K8), FPGA_IO_Transceiver (U2.E18)
RX_D3_P: AD936X (U4.J9), FPGA_IO_Transceiver (U2.E16)
RX_D4_N: AD936X (U4.K7), FPGA_IO_Transceiver (U2.D18)
RX_D4_P: AD936X (U4.J8), FPGA_IO_Transceiver (U2.D17)
RX_D5_N: AD936X (U4.J7), FPGA_IO_Transceiver (U2.C18)
RX_D5_P: AD936X (U4.H8), FPGA_IO_Transceiver (U2.C17)
RX_FRAME_N: AD936X (U4.G7), FPGA_IO_Transceiver (U2.F16)
RX_FRAME_P: AD936X (U4.G8), FPGA_IO_Transceiver (U2.F15)
SCL: mcu2 (U11.R14), camera (P3.5 R57.2)
SCLK: mcu2 (U11.B14), FPGA_IO_MCU (U2.F5)
SDA: mcu2 (U11.R15), camera (P3.3 R56.2)
TEST/ENABLE: AD936X (U4.C4), FPGA_IO_Transceiver (U2.A6)
TX_D0_N: AD936X (U4.E12), FPGA_IO_Transceiver (U2.K18)
TX_D0_P: AD936X (U4.D11), FPGA_IO_Transceiver (U2.K17)
TX_D1_N: AD936X (U4.E11), FPGA_IO_Transceiver (U2.L18)
TX_D1_P: AD936X (U4.D10), FPGA_IO_Transceiver (U2.L17)
TX_D2_N: AD936X (U4.E10), FPGA_IO_Transceiver (U2.M18)
TX_D2_P: AD936X (U4.D9), FPGA_IO_Transceiver (U2.M16)
TX_D3_N: AD936X (U4.E9), FPGA_IO_Transceiver (U2.N18)
TX_D3_P: AD936X (U4.D8), FPGA_IO_Transceiver (U2.N17)
TX_D4_N: AD936X (U4.E8), FPGA_IO_Transceiver (U2.P18)
TX_D4_P: AD936X (U4.D7), FPGA_IO_Transceiver (U2.P17)
TX_D5_N: AD936X (U4.F8), FPGA_IO_Transceiver (U2.T18)
TX_D5_P: AD936X (U4.E7), FPGA_IO_Transceiver (U2.T17)
TX_FRAME_N: AD936X (U4.H9), FPGA_IO_Transceiver (U2.J18)
TX_FRAME_P: AD936X (U4.G9), FPGA_IO_Transceiver (U2.J16)
TXNRX: AD936X (U4.H4), FPGA_IO_Transceiver (U2.B9)
USB_HS_CK: USB_HS_PHY (U9.14), mcu2 (U11.P4)
USB_HS_D0: USB_HS_PHY (U9.24), mcu2 (U11.R2)
USB_HS_D1: USB_HS_PHY (U9.23), mcu2 (U11.R5)
USB_HS_D2: USB_HS_PHY (U9.22), mcu2 (U11.R4)
USB_HS_D3: USB_HS_PHY (U9.21), mcu2 (U11.R12)
USB_HS_D4: USB_HS_PHY (U9.20), mcu2 (U11.R13)
USB_HS_D5: USB_HS_PHY (U9.19), mcu2 (U11.P12)
USB_HS_D6: USB_HS_PHY (U9.18), mcu2 (U11.P13)
USB_HS_D7: USB_HS_PHY (U9.17), mcu2 (U11.A6)
USB_HS_DIR: USB_HS_PHY (U9.12), mcu2 (U11.M4)
USB_HS_NXT: USB_HS_PHY (U9.11), mcu2 (U11.M5)
USB_HS_RESET: USB_HS_PHY (R64.1 U9.9), mcu2 (U11.P2)
USB_HS_STP: USB_HS_PHY (U9.13), mcu2 (U11.M2)
VSYNC: FPGA_IO_MCU (U2.V10), camera (P3.7)